# EAGLE schematic Tractive System Board Rev2 (EAGLE 9.6.2)

## Sheet 1 of 4
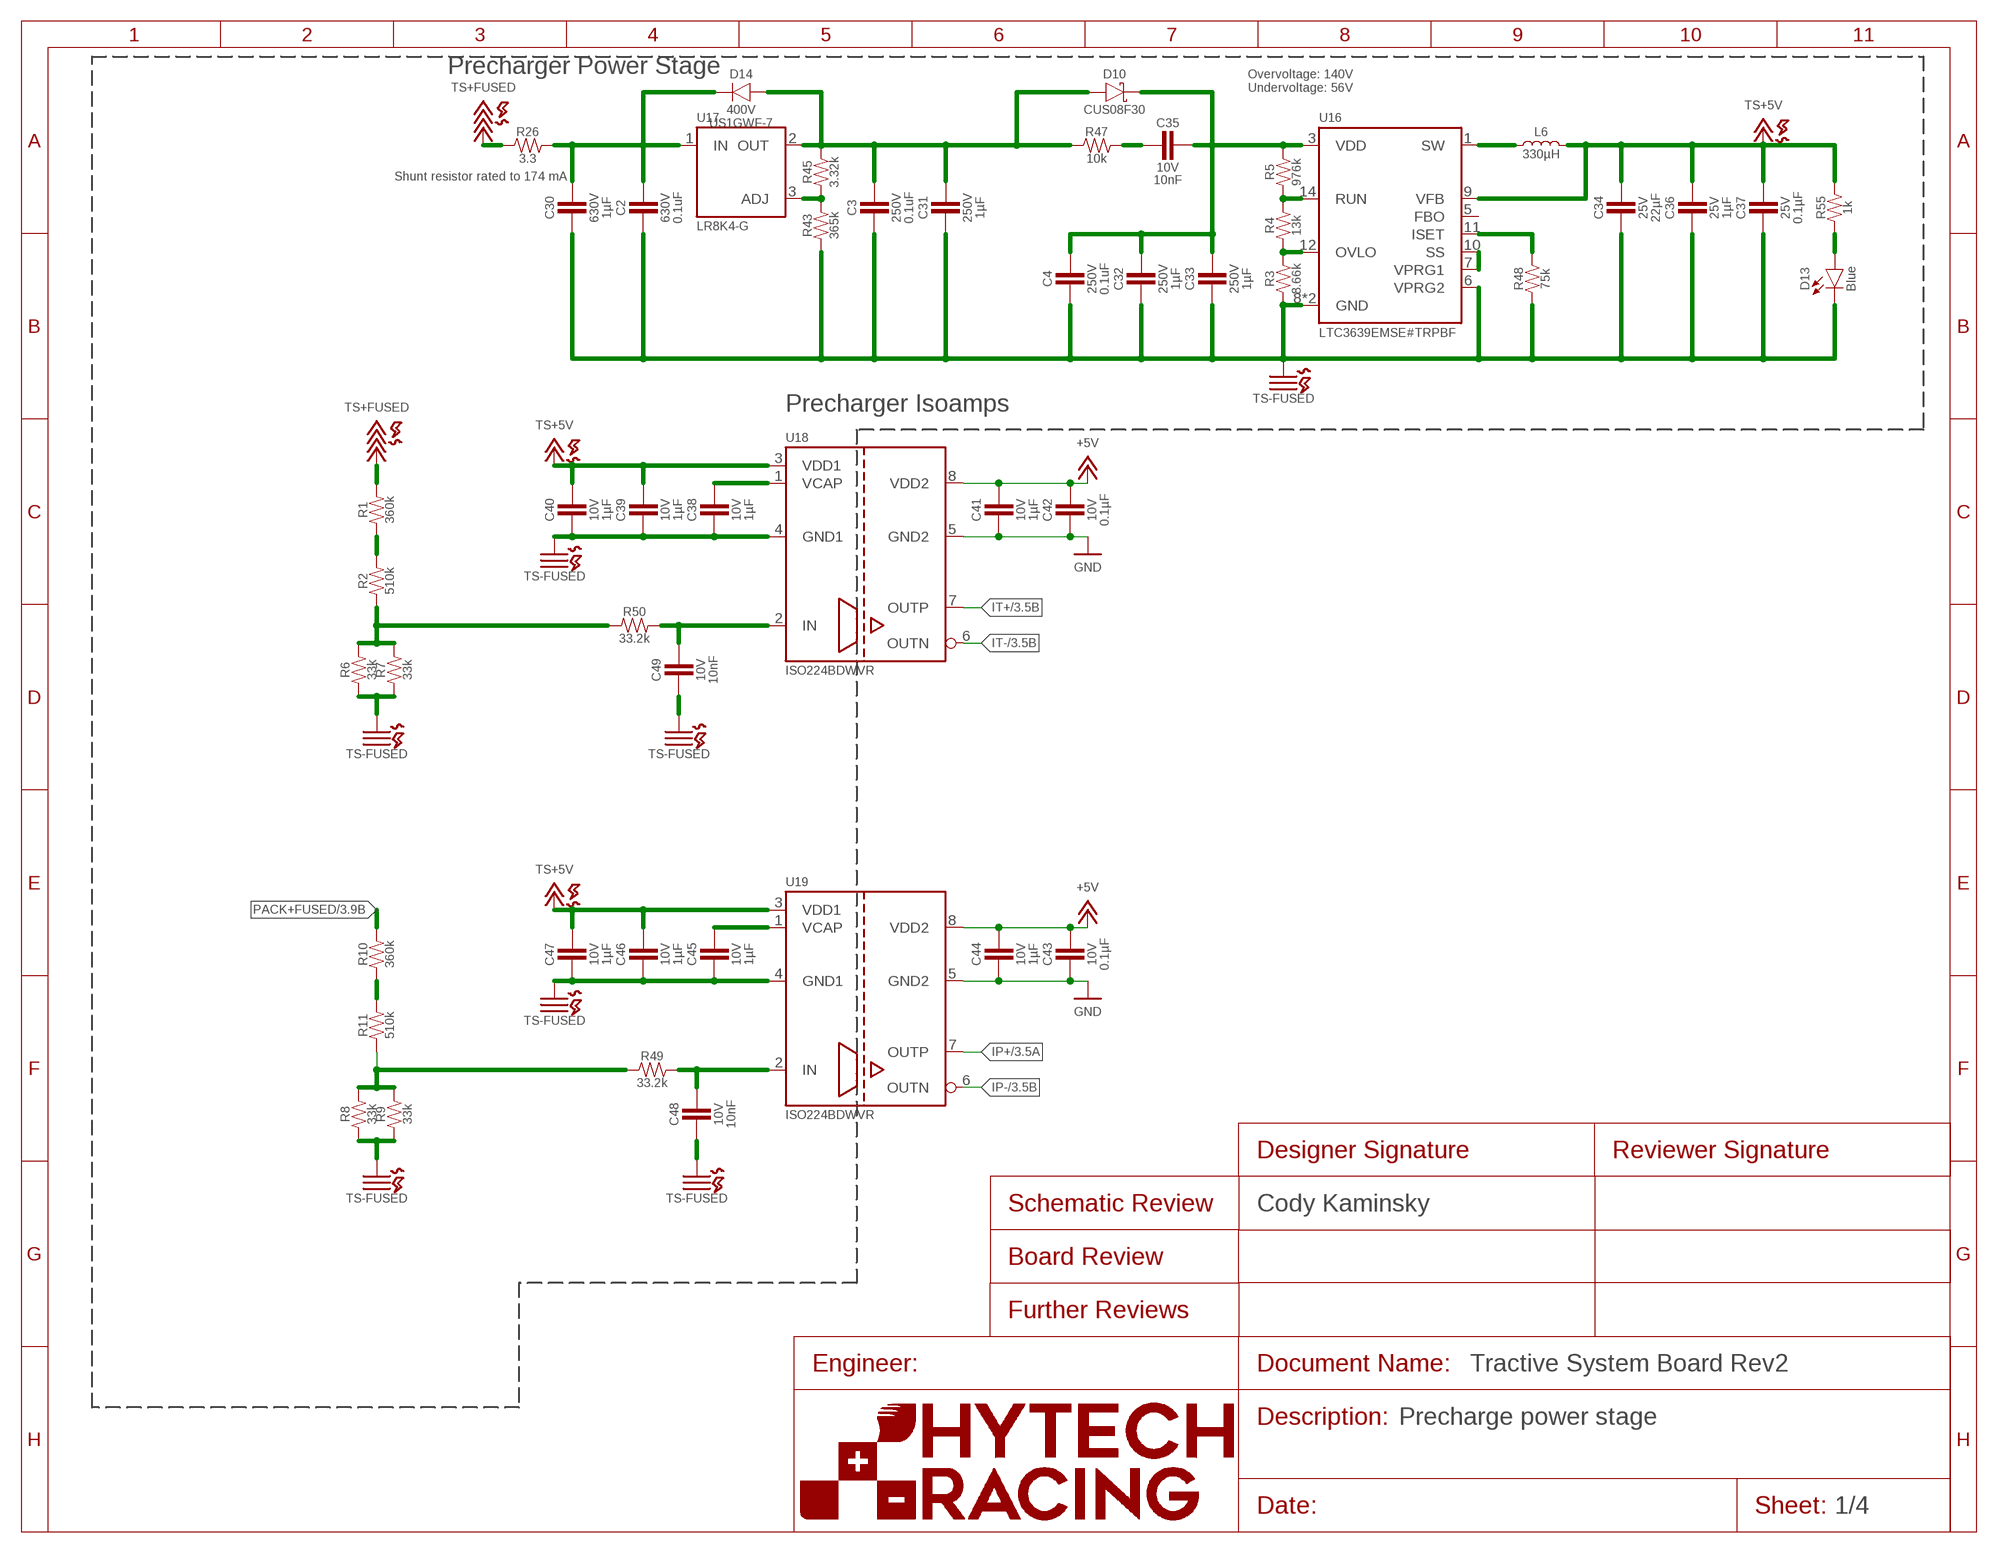
[diagram p0: schematic, sheet 1]
FRAME5 (FRAME): DESCRIPTION_1: Precharge power stage; DESIGNER_SCHEMATIC: Cody Kaminsky

### Parts
C2  CAPACITOR_2220_630V_0.1UF  [2220-CAP]
C3  CAPACITOR_1206_250V_0.1UF  [1206-CAP]
C4  CAPACITOR_1206_250V_0.1UF  [1206-CAP]
C30  CAPACITOR_2220_630V_1UF  [2220-CAP]
C31  CAPACITOR_2220_250V_1UF  [2220-CAP]
C32  CAPACITOR_2220_250V_1UF  [2220-CAP]
C33  CAPACITOR_2220_250V_1UF  [2220-CAP]
C34  CAPACITOR_0805_25V_22UF  [0805-CAP]
C35  CAPACITOR_0603_10V_10NF  [0603-CAP]
C36  CAPACITOR_0603_25V_1UF  [0603-CAP]
C37  CAPACITOR_0603_25V_0.1UF  [0603-CAP]
C38  CAPACITOR_0603_10V_1UF  [0603-CAP]
C39  CAPACITOR_0603_10V_1UF  [0603-CAP]
C40  CAPACITOR_0603_10V_1UF  [0603-CAP]
C41  CAPACITOR_0603_10V_1UF  [0603-CAP]
C42  CAPACITOR_0603_10V_0.1UF  [0603-CAP]
C43  CAPACITOR_0603_10V_0.1UF  [0603-CAP]
C44  CAPACITOR_0603_10V_1UF  [0603-CAP]
C45  CAPACITOR_0603_10V_1UF  [0603-CAP]
C46  CAPACITOR_0603_10V_1UF  [0603-CAP]
C47  CAPACITOR_0603_10V_1UF  [0603-CAP]
C48  CAPACITOR_0603_10V_10NF  [0603-CAP]
C49  CAPACITOR_0603_10V_10NF  [0603-CAP]
D10  SCHOTTKY_SOD323_30V  [SOD-323]
D13  LED_0603_BLUE  [0603-LED]
D14  RECTIFIER_400V_SOD123  [SOD123F]
L6  INDUCTOR_SRU1048_330UH  [SRU1048]
R1  RESISTOR_0603_360K  [0603-RES]
R2  RESISTOR_0603_510K  [0603-RES]
R3  RESISTOR_0603_8.66K  [0603-RES]
R4  RESISTOR_0603_13K  [0603-RES]
R5  RESISTOR_0805_976K  [0805-RES]
R6  RESISTOR_0603_33K  [0603-RES]
R7  RESISTOR_0603_33K  [0603-RES]
R8  RESISTOR_0603_33K  [0603-RES]
R9  RESISTOR_0603_33K  [0603-RES]
R10  RESISTOR_0603_360K  [0603-RES]
R11  RESISTOR_0603_510K  [0603-RES]
R26  RESISTOR_0603_3.3  [0603-RES]
R43  RESISTOR_0805_HV365K  [0805-RES]
R45  RESISTOR_0603_3.32K  [0603-RES]
R47  RESISTOR_0603_10K  [0603-RES]
R48  RESISTOR_0603_75K  [0603-RES]
R49  RESISTOR_0603_33.2K  [0603-RES]
R50  RESISTOR_0603_33.2K  [0603-RES]
R55  RESISTOR_0603_1K  [0603-RES]
U16  LTC3639  [MSE16(12)]
U17  VOLTAGE_REGULATOR_ADJ_LR8_DPAK  [DPAK(2-7K1S)]
U18  ISO224B_AIRGAP  [SOIC-08(WIDE,0.295")-AIRGAP]
U19  ISO224B_AIRGAP  [SOIC-08(WIDE,0.295")-AIRGAP]

### Nets
+5V: C41.1 C42.1 C43.1 C44.1 U18.8(VDD2) U19.8(VDD2) ; also sheet 2,3
GND: C41.2 C42.2 C43.2 C44.2 U18.5(GND2) U19.5(GND2) ; also sheet 2,3
IP+: U19.7(OUTP) ; also sheet 3
IP-: U19.6(OUTN) ; also sheet 3
IT+: U18.7(OUTP) ; also sheet 3
IT-: U18.6(OUTN) ; also sheet 3
N$1: R10.1 R11.2
N$2: R3.2 R4.1 U16.12(OVLO)
N$5: R4.2 R5.1 U16.14(RUN)
N$7: R1.1 R2.2
N$8: R43.2 R45.1 U17.3(ADJ)
N$13: R8.2 R9.2 R11.1 R49.1
N$15: C2.1 C30.1 D14.C R26.2 U17.1(IN)
N$23: R2.1 R6.2 R7.2 R50.1
N$35: D13.2(A) R55.1
N$58: C3.1 C31.1 D10.A D14.A R45.2 R47.1 U17.2(OUT)
N$60: C35.2 R47.2
N$61: C4.1 C32.1 C33.1 C35.1 D10.C R5.2 U16.3(VDD)
N$62: C48.1 R49.2 U19.2(IN)
N$63: C49.1 R50.2 U18.2(IN)
N$64: R48.2 U16.11(ISET)
N$65: L6.1 U16.1(SW)
N$69: C45.1 U19.1(VCAP)
N$73: C38.1 U18.1(VCAP)
N$76: U16.7(VPRG1) U16.10(SS)
PACK+FUSED: R10.2 ; also sheet 3
TS+5V: C34.1 C36.1 C37.1 C39.1 C40.1 C46.1 C47.1 L6.2 R55.2 U16.9(VFB) U18.3(VDD1) U19.3(VDD1) ; also sheet 3
TS+FUSED: R1.2 R26.1 ; also sheet 2,3
TS-FUSED: C2.2 C3.2 C4.2 C30.2 C31.2 C32.2 C33.2 C34.2 C36.2 C37.2 C38.2 C39.2 C40.2 C45.2 C46.2 C47.2 C48.2 C49.2 D13.1(C) R3.1 R6.1 R7.1 R8.1 R9.1 R43.1 R48.1 U16.6(VPRG2) U16.8(GND) U16.16(GND) U18.4(GND1) U19.4(GND1) ; also sheet 2,3
Unconnected: U16.5(FBO)

### Notes on the sheet
- Precharger Power Stage
- Overvoltage: 140V
  Undervoltage: 56V
- Shunt resistor rated to 174 mA
- Precharger Isoamps

## Sheet 2 of 4
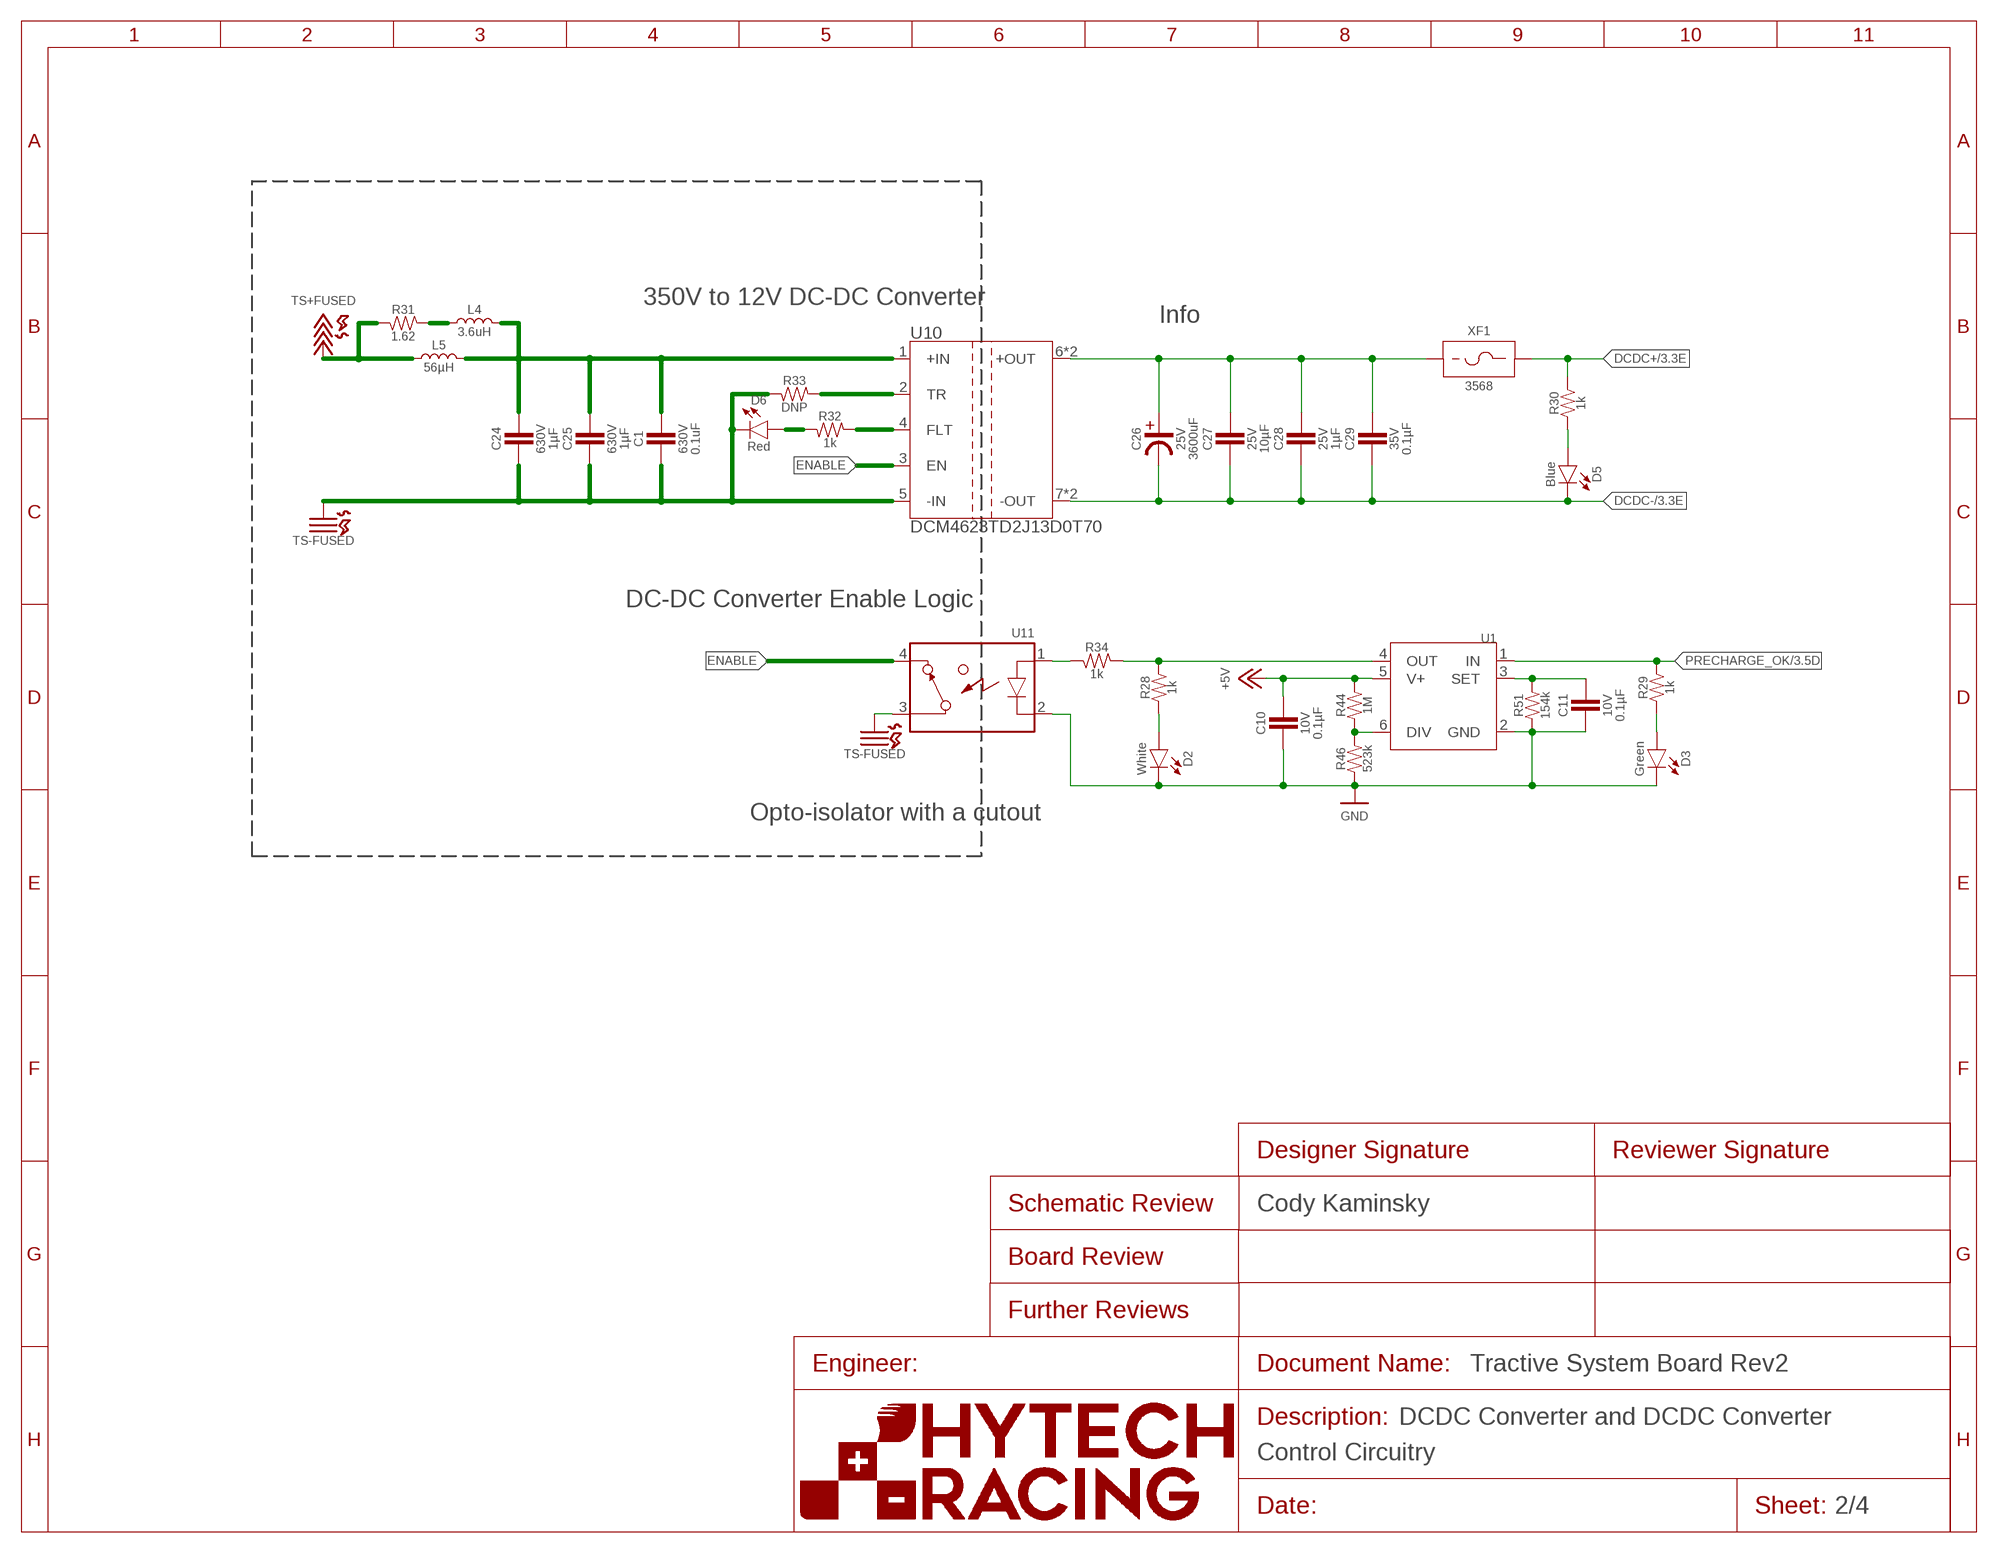
[diagram p1: schematic, sheet 2]
FRAME3 (FRAME): DESCRIPTION_1: DCDC Converter and DCDC Converter; DESCRIPTION_2: Control Circuitry; DESIGNER_SCHEMATIC: Cody Kaminsky

### Parts
C1  CAPACITOR_2220_630V_0.1UF  [2220-CAP]
C10  CAPACITOR_0603_10V_0.1UF  [0603-CAP]
C11  CAPACITOR_0603_10V_0.1UF  [0603-CAP]
C24  CAPACITOR_2220_630V_1UF  [2220-CAP]
C25  CAPACITOR_2220_630V_1UF  [2220-CAP]
C26  CAPACITOR_POLAR__3600UF  [EKYC*MM]
C27  CAPACITOR_0603_25V_10UF  [0603-CAP]
C28  CAPACITOR_0603_25V_1UF  [0603-CAP]
C29  CAPACITOR_0603_35V_0.1UF  [0603-CAP]
D2  LED_0603_WHITE  [0603-LED]
D3  LED_0603_GREEN  [0603-LED]
D5  LED_0603_BLUE  [0603-LED]
D6  LED_0603_RED  [0603-LED]
L4  INDUCTOR_74451133_3.6UH  [74451133]
L5  INDUCTOR_WELMHI_56UH  [WE-LMHI]
R28  RESISTOR_0603_1K  [0603-RES]
R29  RESISTOR_0603_1K  [0603-RES]
R30  RESISTOR_0603_1K  [0603-RES]
R31  RESISTOR_0603_1.62  [0603-RES]
R32  RESISTOR_0603_1K  [0603-RES]
R33  RESISTOR_0603_DNP  [0603-RES]
R34  RESISTOR_0603_1K  [0603-RES]
R44  RESISTOR_0805_1M  [0805-RES]
R46  RESISTOR_0805_523K  [0805-RES]
R51  RESISTOR_0603_154K  [0603-RES]
U1  LTC6994_1  [SOT-23-6]
U10  DCM4623TD2J13D0T70  [DCM4623]
U11  RELAY_SOLIDSTATE_NC_AG  [DIP-4_AIRGAP]
XF1  FUSE_HOLDER_MINIBLADEPTH  [3568]

### Nets
+5V: C10.1 R44.2 U1.5(V+) ; also sheet 1,3
DCDC+: R30.2 XF1.3 XF1.4 ; also sheet 3
DCDC-: C26.-(MINUS) C27.1 C28.1 C29.1 D5.1(C) U10.7(-OUT) U10.9(-OUT) ; also sheet 3
ENABLE: U10.3(EN) U11.4(CONTACT2)
GND: C10.2 C11.2 D2.1(C) D3.1(C) R46.1 R51.1 U1.2(GND) U11.2(CONTROL-) ; also sheet 1,3
N$4: R44.1 R46.2 U1.6(DIV)
N$6: R34.2 U11.1(CONTROL+)
N$14: C11.1 R51.2 U1.3(SET)
N$16: R28.2 R34.1 U1.4(OUT)
N$17: D2.2(A) R28.1
N$18: D5.2(A) R30.1
N$22: D3.2(A) R29.1
N$29: L4.2 R31.1
N$39: C1.1 C24.1 C25.1 L4.1 L5.1 U10.1(+IN)
N$43: D6.2(A) R32.2
N$44: R32.1 U10.4(FLT)
N$45: R33.1 U10.2(TR)
N$46: C26.+(PLUS) C27.2 C28.2 C29.2 U10.6(+OUT) U10.8(+OUT) XF1.1 XF1.2
PRECHARGE_OK: R29.2 U1.1(IN) ; also sheet 3
TS+FUSED: L5.2 R31.2 ; also sheet 1,3
TS-FUSED: C1.2 C24.2 C25.2 D6.1(C) R33.2 U10.5(-IN) U11.3(CONTACT1) ; also sheet 1,3

### Notes on the sheet
- 350V to 12V DC-DC Converter
- Info
- DC-DC Converter Enable Logic
- Opto-isolator with a cutout

## Sheet 3 of 4
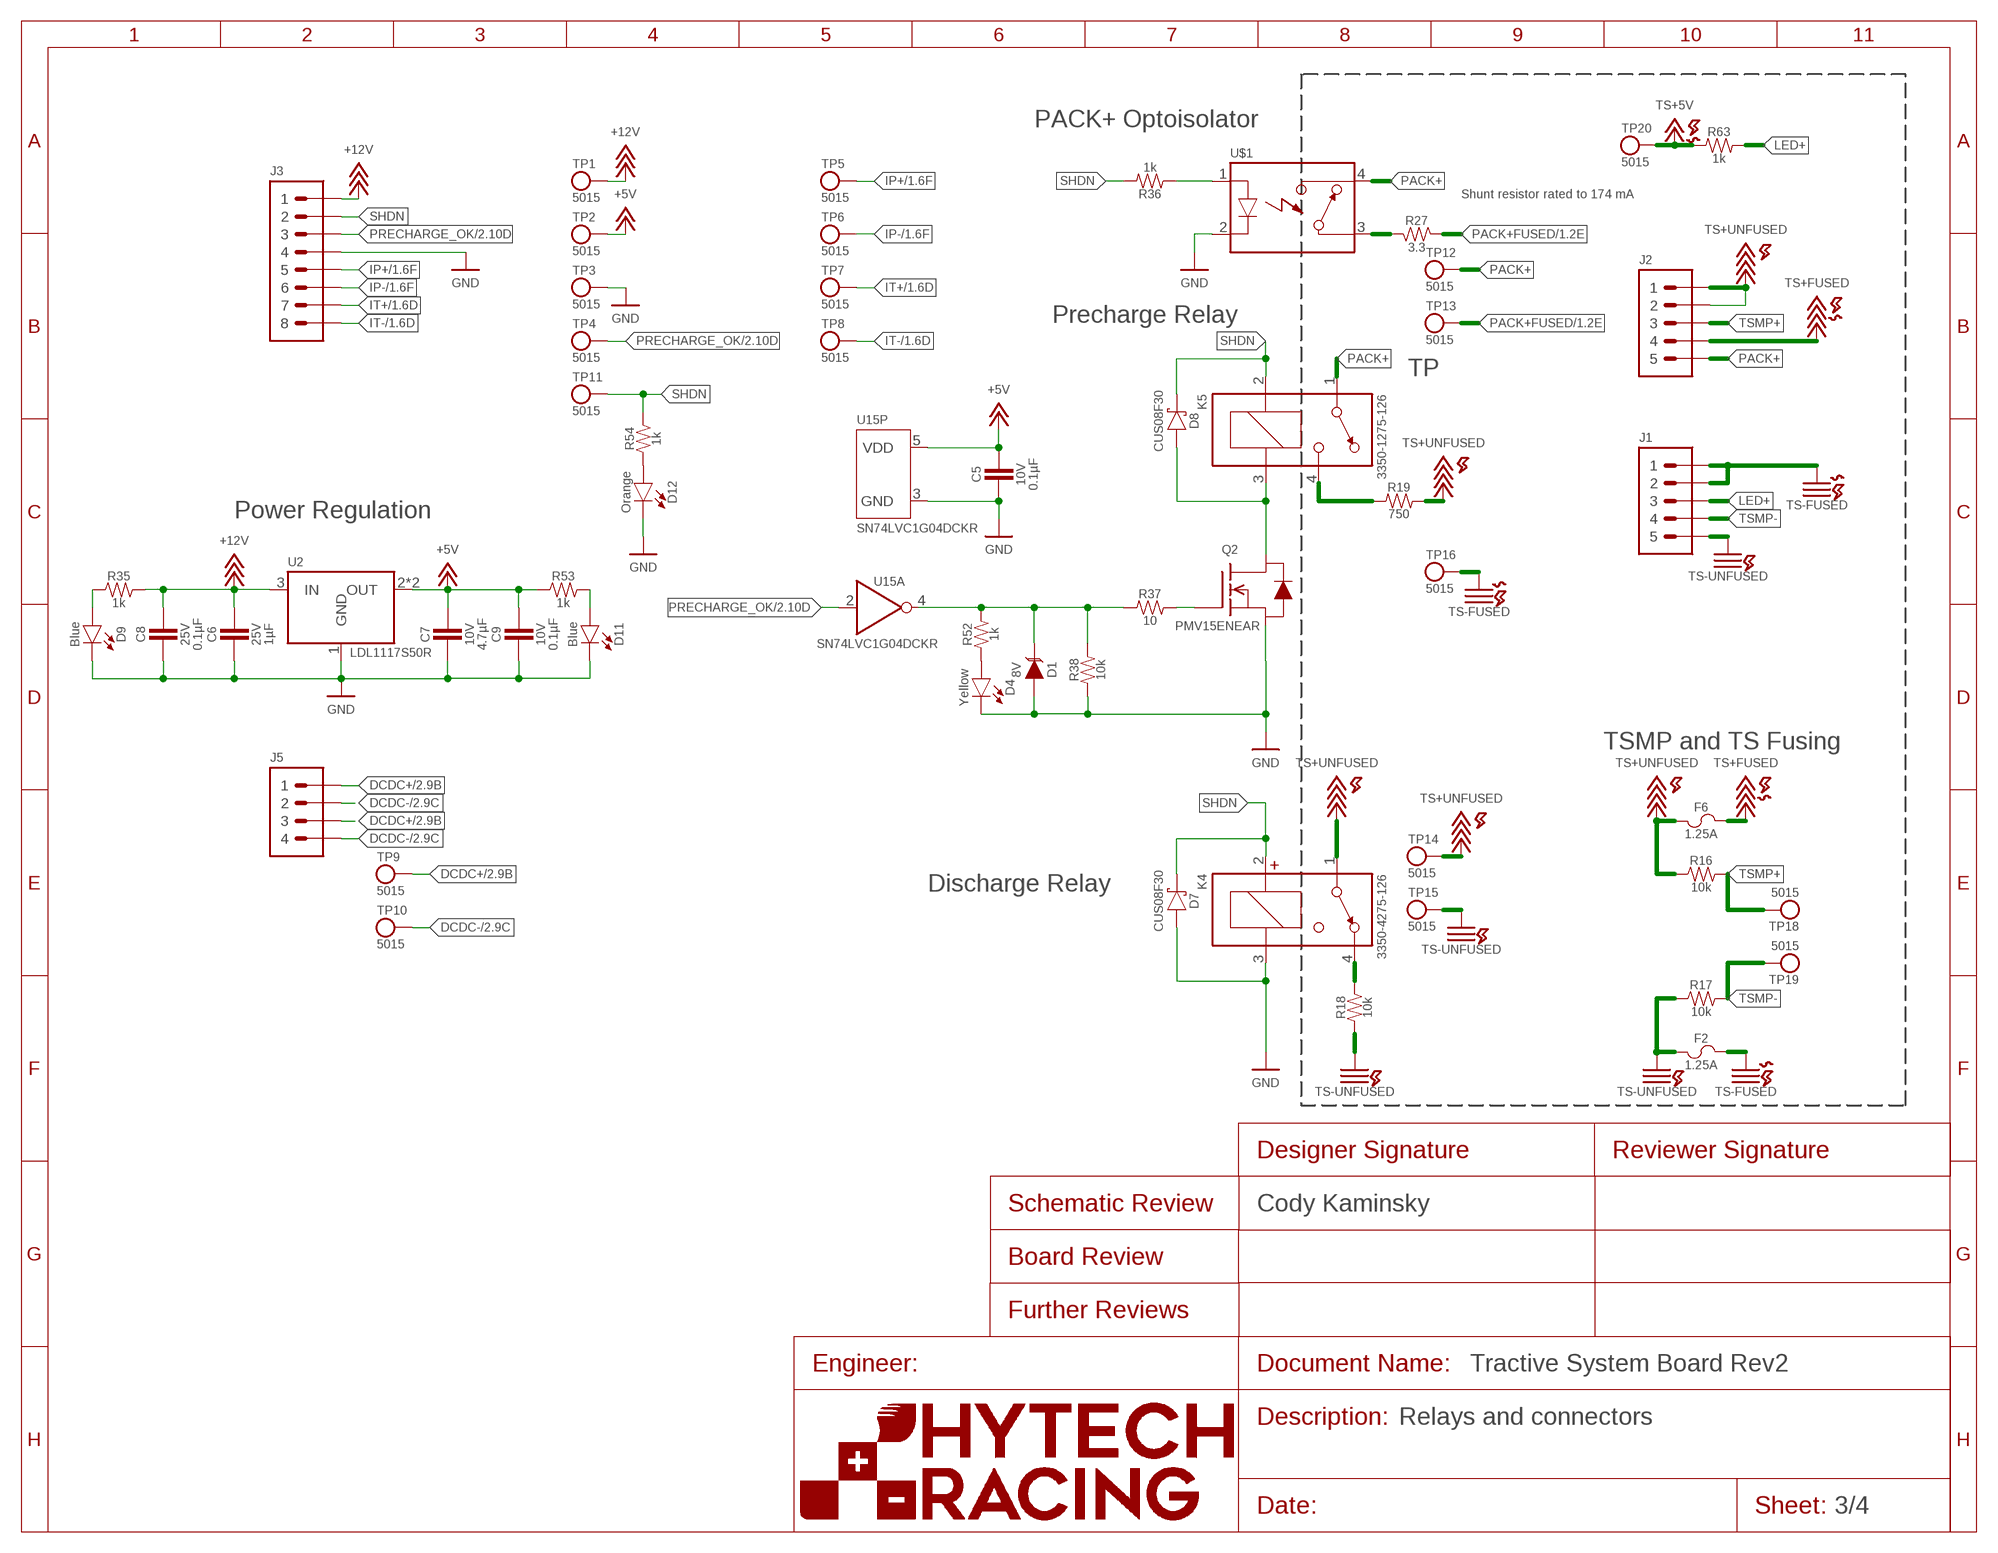
[diagram p2: schematic, sheet 3]
FRAME4 (FRAME): DESCRIPTION_1: Relays and connectors; DESIGNER_SCHEMATIC: Cody Kaminsky

### Parts
C5  CAPACITOR_0603_10V_0.1UF  [0603-CAP]
C6  CAPACITOR_0603_25V_1UF  [0603-CAP]
C7  CAPACITOR_0603_10V_4.7UF  [0603-CAP]
C8  CAPACITOR_0603_25V_0.1UF  [0603-CAP]
C9  CAPACITOR_0603_10V_0.1UF  [0603-CAP]
D1  TVS_8V  [SOT-23]
D4  LED_0603_YELLOW  [0603-LED]
D7  SCHOTTKY_SOD323_30V  [SOD-323]
D8  SCHOTTKY_SOD323_30V  [SOD-323]
D9  LED_0603_BLUE  [0603-LED]
D11  LED_0603_BLUE  [0603-LED]
D12  LED_0603_ORANGE  [0603-LED]
F2  FUSE_0885_1.25  [0885]
F6  FUSE_0885_1.25  [0885]
J1  CONNECTOR-5_MICRO_V6S_  [MOLEX_MICROFIT_PTH_VERTICAL_06_SINGLE_SPACED]
J2  CONNECTOR-5_MICRO_V7S_  [MOLEX_MICROFIT_PTH_VERTICAL_07_SINGLE_SPACED]
J3  CONNECTOR-8_S_S  [FLEX_STACK_PTH_08_DUAL]
J5  CONNECTOR-4__  [MOLEX_MICROFIT_PTH_VERTICAL_04_DUAL]
K4  RELAY_SPST_NC_POLARIZED_3550_12  [335X]
K5  RELAY_SPST_NO_3550_12  [335X]
Q2  TRANSISTOR_N_MOS__PMV15ENEA  [SOT-23]
R16  RESISTOR_B20_10K  [B20]
R17  RESISTOR_B20_10K  [B20]
R18  RESISTOR_B20_10K  [B20]
R19  RESISTOR_B20_750  [B20]
R27  RESISTOR_0603_3.3  [0603-RES]
R35  RESISTOR_0603_1K  [0603-RES]
R36  RESISTOR_0603_1K  [0603-RES]
R37  RESISTOR_0603_10  [0603-RES]
R38  RESISTOR_0603_10K  [0603-RES]
R52  RESISTOR_0603_1K  [0603-RES]
R53  RESISTOR_0603_1K  [0603-RES]
R54  RESISTOR_0603_1K  [0603-RES]
R63  RESISTOR_0603_1K  [0603-RES]
TP1  TEST_POINT  [MICRO_MINIATURE]
TP2  TEST_POINT  [MICRO_MINIATURE]
TP3  TEST_POINT  [MICRO_MINIATURE]
TP4  TEST_POINT  [MICRO_MINIATURE]
TP5  TEST_POINT  [MICRO_MINIATURE]
TP6  TEST_POINT  [MICRO_MINIATURE]
TP7  TEST_POINT  [MICRO_MINIATURE]
TP8  TEST_POINT  [MICRO_MINIATURE]
TP9  TEST_POINT  [MICRO_MINIATURE]
TP10  TEST_POINT  [MICRO_MINIATURE]
TP11  TEST_POINT  [MICRO_MINIATURE]
TP12  TEST_POINT  [MICRO_MINIATURE]
TP13  TEST_POINT  [MICRO_MINIATURE]
TP14  TEST_POINT  [MICRO_MINIATURE]
TP15  TEST_POINT  [MICRO_MINIATURE]
TP16  TEST_POINT  [MICRO_MINIATURE]
TP18  TEST_POINT  [MICRO_MINIATURE]
TP19  TEST_POINT  [MICRO_MINIATURE]
TP20  TEST_POINT  [MICRO_MINIATURE]
U2  VOLTAGE_REGULATOR_SOT223_5V  [SOT223]
U15  LOGICGATE_INVERTER_DCKR  [SC-70-5]
U$1  RELAY_SOLIDSTATE_NO  [DIP-4]

### Nets
+5V: C5.1 C7.1 C9.1 R53.1 TP2.1 U2.2(OUT) U2.4(OUT) U15.5(P:VDD) ; also sheet 1,2
+12V: C6.1 C8.1 J3.1 R35.2 TP1.1 U2.3(IN)
DCDC+: J5.1 J5.3 TP9.1 ; also sheet 2
DCDC-: J5.2 J5.4 TP10.1 ; also sheet 2
GND: C5.2 C6.2 C7.2 C8.2 C9.2 D1.1(A) D4.1(C) D7.A D9.1(C) D11.1(C) D12.1(C) J3.4 K4.3(COIL-) Q2.2(S) R38.1 TP3.1 U2.1(GND) U15.3(P:GND) U$1.2(CONTROL-) ; also sheet 1,2
IP+: J3.5 TP5.1 ; also sheet 1
IP-: J3.6 TP6.1 ; also sheet 1
IT+: J3.7 TP7.1 ; also sheet 1
IT-: J3.8 TP8.1 ; also sheet 1
LED+: J1.3 R63.2
N$3: Q2.1(G) R37.2
N$24: D4.2(A) R52.1
N$25: D9.2(A) R35.1
N$30: D11.2(A) R53.2
N$31: D12.2(A) R54.1
N$40: D8.A K5.3(COIL-) Q2.3(D)
N$50: K5.4(CONTACT2) R19.1
N$51: K4.4(CONTACT2) R18.2
N$52: D1.3(C) R37.1 R38.2 R52.2 U15.4(A:!IN)
N$53: R36.1 U$1.1(CONTROL+)
N$57: R27.2 U$1.3(CONTACT1)
PACK+: J2.5 K5.1(CONTACT1) TP12.1 U$1.4(CONTACT2)
PACK+FUSED: R27.1 TP13.1 ; also sheet 1
PRECHARGE_OK: J3.3 TP4.1 U15.2(A:IN) ; also sheet 2
SHDN: D7.C D8.C J3.2 K4.2(COIL+) K5.2(COIL+) R36.2 R54.2 TP11.1
TS+5V: R63.1 TP20.1 ; also sheet 1
TS+FUSED: F6.2 J2.4 ; also sheet 1,2
TS+UNFUSED: F6.1 J2.1 J2.2 K4.1(CONTACT1) R16.1 R19.2 TP14.1
TS-FUSED: F2.2 J1.1 J1.2 TP16.1 ; also sheet 1,2
TS-UNFUSED: F2.1 J1.5 R17.1 R18.1 TP15.1
TSMP+: J2.3 R16.2 TP18.1
TSMP-: J1.4 R17.2 TP19.1

### Notes on the sheet
- PACK+ Optoisolator
- Shunt resistor rated to 174 mA
- Precharge Relay
- TP
- Power Regulation
- TSMP and TS Fusing
- Discharge Relay

## Sheet 4 of 4
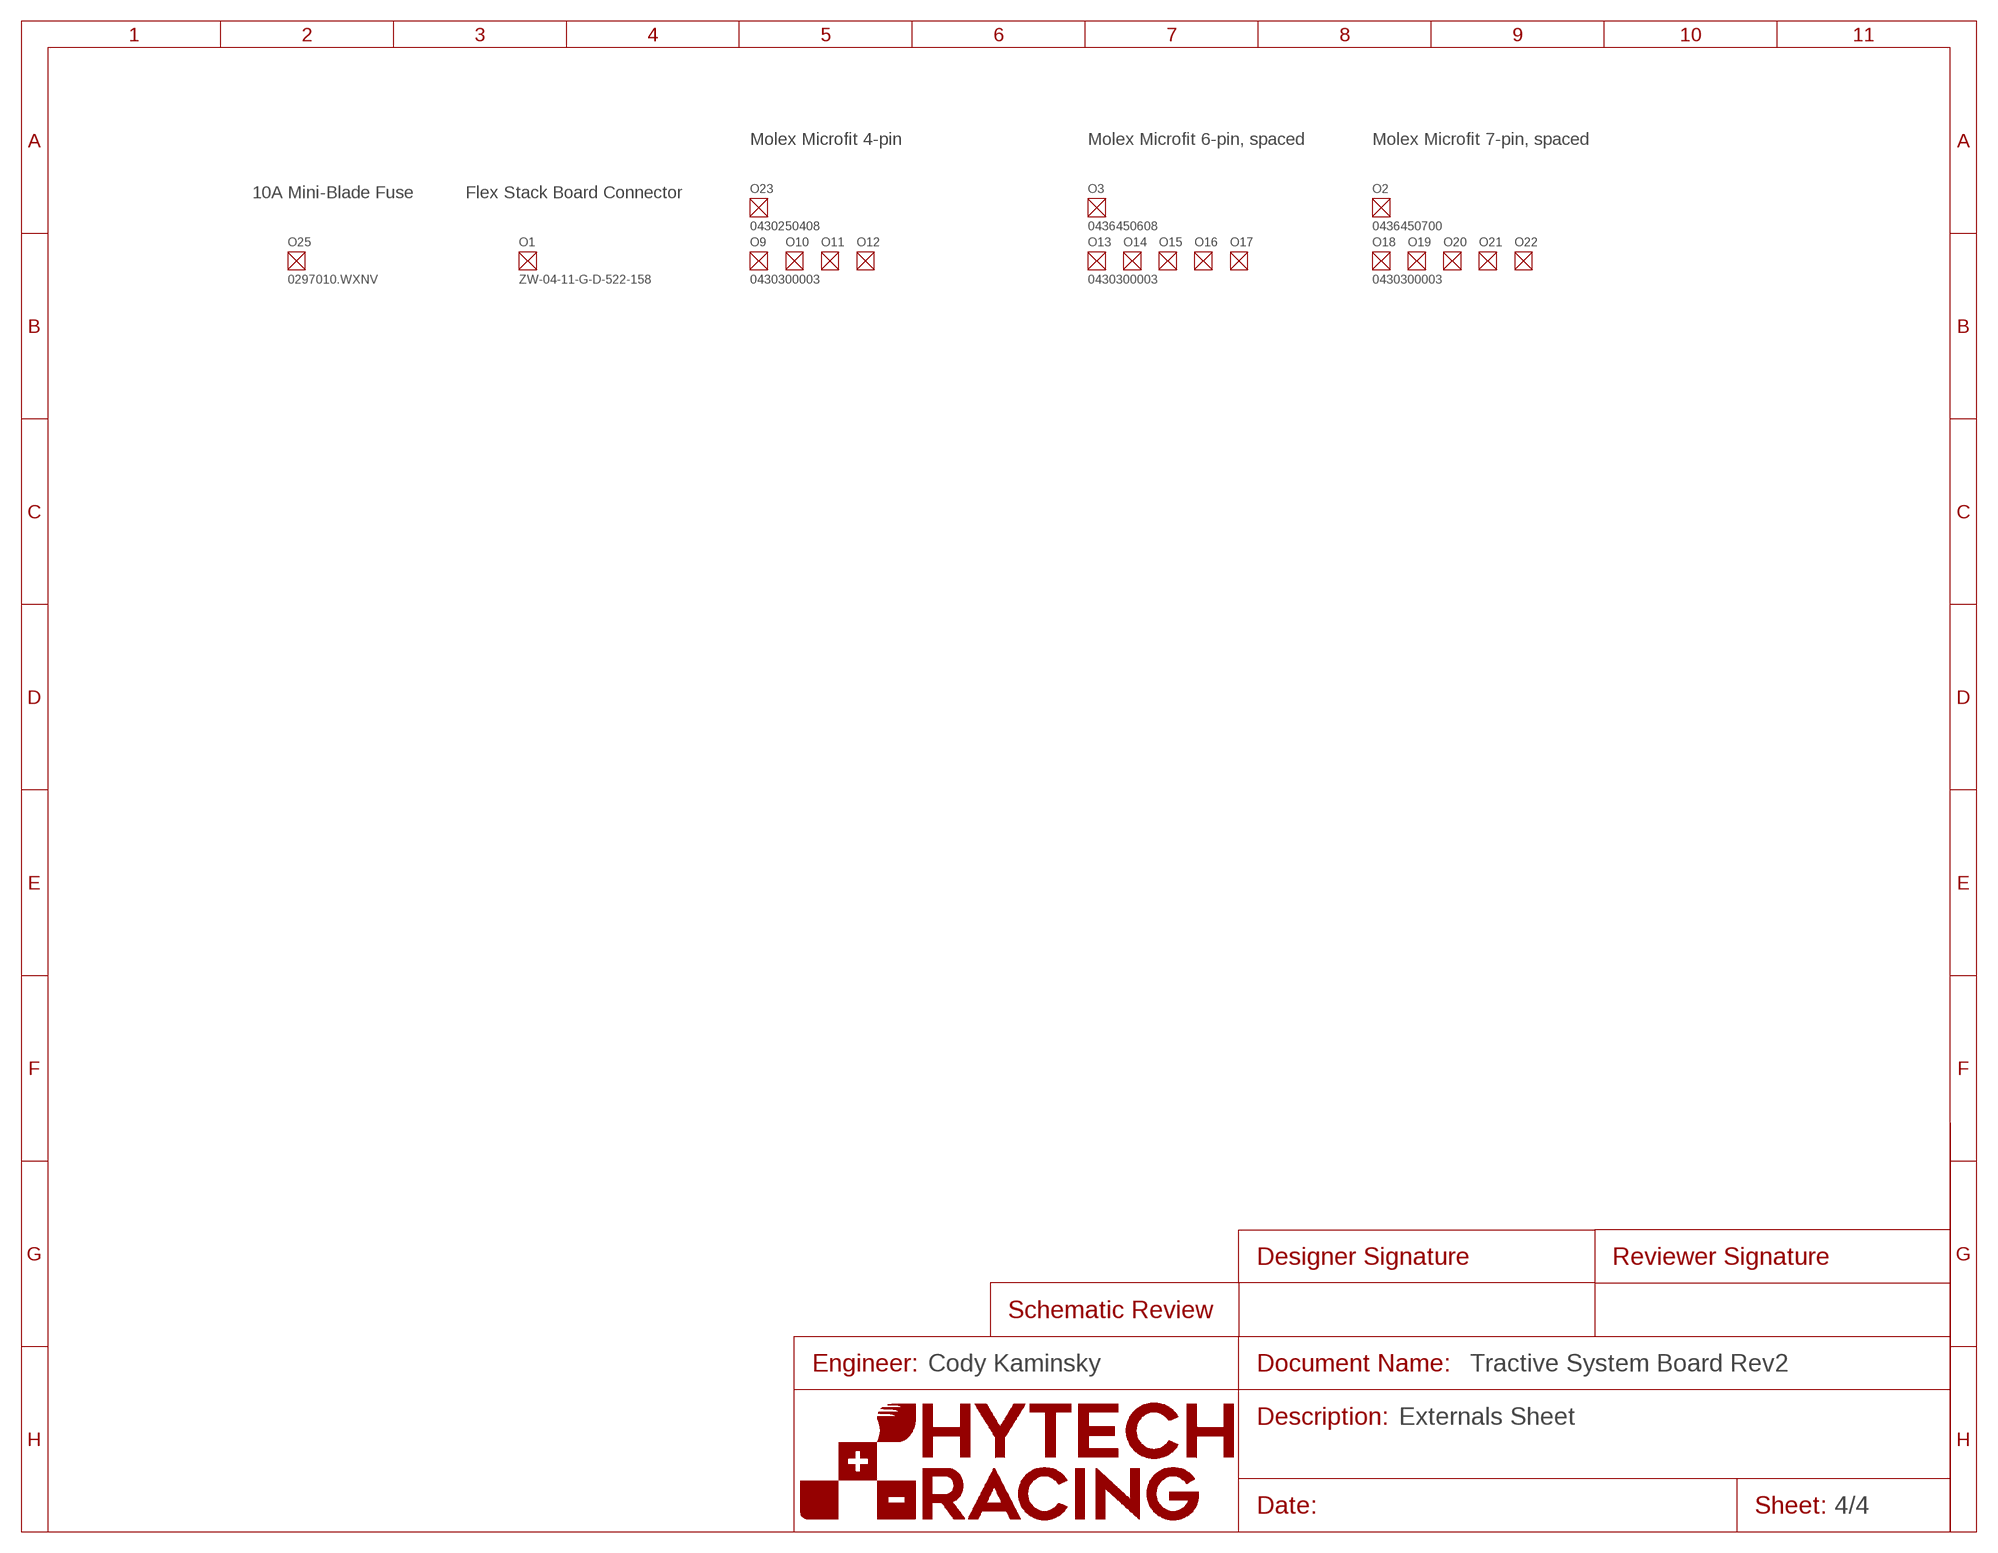
[diagram p3: schematic, sheet 4]
O1 (RECEPTACLE-8_FLEXSTACK): DKPN: ZW-04-11-G-D-522-158-ND; MANUFACTURER: Samtec Inc; MOPN: 200-ZW0411GD522158; MPN: ZW-04-11-G-D-522-158
O2 (RECEPTACLE-7_MICROFIT): DKPN: WM2405-ND; MANUFACTURER: Molex; MOPN: 538-43645-0700; MPN: 0436450700
O3 (RECEPTACLE-6_SINGLE_MICROFIT): DKPN: WM13217-ND; MANUFACTURER: Molex; MOPN: 538-43645-0608; MPN: 0436450608
O9 (CRIMP_MICROFIT_20-24): DKPN: WM2776CT-ND; GAUGE: 20-24; MANUFACTURER: Molex; MOPN: 538-43030-0003; MPN: 0430300003
O10 (CRIMP_MICROFIT_20-24): DKPN: WM2776CT-ND; GAUGE: 20-24; MANUFACTURER: Molex; MOPN: 538-43030-0003; MPN: 0430300003
O11 (CRIMP_MICROFIT_20-24): DKPN: WM2776CT-ND; GAUGE: 20-24; MANUFACTURER: Molex; MOPN: 538-43030-0003; MPN: 0430300003
O12 (CRIMP_MICROFIT_20-24): DKPN: WM2776CT-ND; GAUGE: 20-24; MANUFACTURER: Molex; MOPN: 538-43030-0003; MPN: 0430300003
O13 (CRIMP_MICROFIT_20-24): DKPN: WM2776CT-ND; GAUGE: 20-24; MANUFACTURER: Molex; MOPN: 538-43030-0003; MPN: 0430300003
O14 (CRIMP_MICROFIT_20-24): DKPN: WM2776CT-ND; GAUGE: 20-24; MANUFACTURER: Molex; MOPN: 538-43030-0003; MPN: 0430300003
O15 (CRIMP_MICROFIT_20-24): DKPN: WM2776CT-ND; GAUGE: 20-24; MANUFACTURER: Molex; MOPN: 538-43030-0003; MPN: 0430300003
O16 (CRIMP_MICROFIT_20-24): DKPN: WM2776CT-ND; GAUGE: 20-24; MANUFACTURER: Molex; MOPN: 538-43030-0003; MPN: 0430300003
O17 (CRIMP_MICROFIT_20-24): DKPN: WM2776CT-ND; GAUGE: 20-24; MANUFACTURER: Molex; MOPN: 538-43030-0003; MPN: 0430300003
O18 (CRIMP_MICROFIT_20-24): DKPN: WM2776CT-ND; GAUGE: 20-24; MANUFACTURER: Molex; MOPN: 538-43030-0003; MPN: 0430300003
O19 (CRIMP_MICROFIT_20-24): DKPN: WM2776CT-ND; GAUGE: 20-24; MANUFACTURER: Molex; MOPN: 538-43030-0003; MPN: 0430300003
O20 (CRIMP_MICROFIT_20-24): DKPN: WM2776CT-ND; GAUGE: 20-24; MANUFACTURER: Molex; MOPN: 538-43030-0003; MPN: 0430300003
O21 (CRIMP_MICROFIT_20-24): DKPN: WM2776CT-ND; GAUGE: 20-24; MANUFACTURER: Molex; MOPN: 538-43030-0003; MPN: 0430300003
O22 (CRIMP_MICROFIT_20-24): DKPN: WM2776CT-ND; GAUGE: 20-24; MANUFACTURER: Molex; MOPN: 538-43030-0003; MPN: 0430300003
O23 (RECEPTACLE-4_MICROFIT): DKPN: WM11225-ND; MANUFACTURER: Molex; MOPN: 538-43025-0408; MPN: 0430250408
O25 (FUSE_MINI_BLADE_10): DKPN: F991-ND; MANUFACTURER: Littelfuse; MOPN: 576-0297010.WXNV; MPN: 0297010.WXNV
U$49 (FRAME_SCHEMATIC_ONLY): DESCRIPTION_1: Externals Sheet; ENGINEER: Cody Kaminsky

### Notes on the sheet
- Molex Microfit 4-pin | Molex Microfit 6-pin, spaced | Molex Microfit 7-pin, spaced
- 10A Mini-Blade Fuse | Flex Stack Board Connector

## Library data of the parts
C1 C2 = HyTechDevices:CAPACITOR_?_*: Capacitor, Non-Polarized VJ...1BC Series Datasheet <https://www.mouser.com/datasheet/2/427/vjw1bcbascomseries-1762447.pdf> Samsung Datasheet <https://www.mouser.com/datasheet/2/585/MLCC-1837944.pdf> Walsin Datasheet <https://www.mouser.com/datasheet/2/210/WTC_MLCC_General_Purpose-1534899.pdf> GRM188R61A226ME15D <https://www.mouser.com/datasheet/2/281/1/GRM188R61A226ME15_02A-1985787.pdf> GRM188R61E106MA73D <https://www.mouser.com/datasheet/2/281/1/GRM188R61E106MA73_01A-1985806.pdf> 885012006013 <https://www.mouser.com/datasheet/2/445/885012006013-1726946.pdf> 2220Y6300105KXTWS2 <https://www.mouser.com/datasheet/2/218/SMD_High_and_Std_StackiCap_P62-1825512.pdf> Yageo Class 2, X5R <https://www.mouser.com/datasheet/2/447/UPY_GPHC_X5R_4V_to_50V_26-1827097.pdf> TDK C Series <https://www.mouser.com/ProductDetail/TDK/C3216X5R1V226M160AC?qs=%2Fha2pyFadujbcx9jh7lYl%2F4NeMoXFhdc8AqVWNq4wW6M2y7zl6GzBuhgtI0ngznN> AVX Automotive MLCC <https://www.mouser.com/datasheet/2/40/AutoMLCC-777028.pdf> KEMET X7R Series <https://www.mouser.com/datasheet/2/212/KEM_C1002_X7R_SMD-1102033.pdf>; CAPACITANCE: 0.1uF; DKPN: 445-11980-2-ND; MANUFACTURER: TDK Coporation; MOPN: 810-C5750CH2J104K2KC; MPN: C5750CH2J104K280KC; TOLERANCE: 10%; VOLTAGE: 630V
C3 C4 = HyTechDevices:CAPACITOR_?_*: Capacitor, Non-Polarized VJ...1BC Series Datasheet <https://www.mouser.com/datasheet/2/427/vjw1bcbascomseries-1762447.pdf> Samsung Datasheet <https://www.mouser.com/datasheet/2/585/MLCC-1837944.pdf> Walsin Datasheet <https://www.mouser.com/datasheet/2/210/WTC_MLCC_General_Purpose-1534899.pdf> GRM188R61A226ME15D <https://www.mouser.com/datasheet/2/281/1/GRM188R61A226ME15_02A-1985787.pdf> GRM188R61E106MA73D <https://www.mouser.com/datasheet/2/281/1/GRM188R61E106MA73_01A-1985806.pdf> 885012006013 <https://www.mouser.com/datasheet/2/445/885012006013-1726946.pdf> 2220Y6300105KXTWS2 <https://www.mouser.com/datasheet/2/218/SMD_High_and_Std_StackiCap_P62-1825512.pdf> Yageo Class 2, X5R <https://www.mouser.com/datasheet/2/447/UPY_GPHC_X5R_4V_to_50V_26-1827097.pdf> TDK C Series <https://www.mouser.com/ProductDetail/TDK/C3216X5R1V226M160AC?qs=%2Fha2pyFadujbcx9jh7lYl%2F4NeMoXFhdc8AqVWNq4wW6M2y7zl6GzBuhgtI0ngznN> AVX Automotive MLCC <https://www.mouser.com/datasheet/2/40/AutoMLCC-777028.pdf> KEMET X7R Series <https://www.mouser.com/datasheet/2/212/KEM_C1002_X7R_SMD-1102033.pdf>; CAPACITANCE: 0.1uF; DKPN: 445-6079-2-ND; MANUFACTURER: TDK Corporation; MOPN: 810-C3216X7R2E104KT5; MPN: C3216X7R2E104K160AM; TOLERANCE: 10%; VOLTAGE: 250V
C5 C9-C11 C42 C43 = HyTechDevices:CAPACITOR_?_*: Capacitor, Non-Polarized VJ...1BC Series Datasheet <https://www.mouser.com/datasheet/2/427/vjw1bcbascomseries-1762447.pdf> Samsung Datasheet <https://www.mouser.com/datasheet/2/585/MLCC-1837944.pdf> Walsin Datasheet <https://www.mouser.com/datasheet/2/210/WTC_MLCC_General_Purpose-1534899.pdf> GRM188R61A226ME15D <https://www.mouser.com/datasheet/2/281/1/GRM188R61A226ME15_02A-1985787.pdf> GRM188R61E106MA73D <https://www.mouser.com/datasheet/2/281/1/GRM188R61E106MA73_01A-1985806.pdf> 885012006013 <https://www.mouser.com/datasheet/2/445/885012006013-1726946.pdf> 2220Y6300105KXTWS2 <https://www.mouser.com/datasheet/2/218/SMD_High_and_Std_StackiCap_P62-1825512.pdf> Yageo Class 2, X5R <https://www.mouser.com/datasheet/2/447/UPY_GPHC_X5R_4V_to_50V_26-1827097.pdf> TDK C Series <https://www.mouser.com/ProductDetail/TDK/C3216X5R1V226M160AC?qs=%2Fha2pyFadujbcx9jh7lYl%2F4NeMoXFhdc8AqVWNq4wW6M2y7zl6GzBuhgtI0ngznN> AVX Automotive MLCC <https://www.mouser.com/datasheet/2/40/AutoMLCC-777028.pdf> KEMET X7R Series <https://www.mouser.com/datasheet/2/212/KEM_C1002_X7R_SMD-1102033.pdf>; CAPACITANCE: 0.1µF; DKPN: 720-1688-1-ND; MANUFACTURER: Vishay Vitramon; MOPN: 77-VJ0603Y104JXQPBC; MPN: VJ0603Y104JXQPW1BC; TOLERANCE: 5%; VOLTAGE: 10V
C6 C28 C36 = HyTechDevices:CAPACITOR_?_*: Capacitor, Non-Polarized VJ...1BC Series Datasheet <https://www.mouser.com/datasheet/2/427/vjw1bcbascomseries-1762447.pdf> Samsung Datasheet <https://www.mouser.com/datasheet/2/585/MLCC-1837944.pdf> Walsin Datasheet <https://www.mouser.com/datasheet/2/210/WTC_MLCC_General_Purpose-1534899.pdf> GRM188R61A226ME15D <https://www.mouser.com/datasheet/2/281/1/GRM188R61A226ME15_02A-1985787.pdf> GRM188R61E106MA73D <https://www.mouser.com/datasheet/2/281/1/GRM188R61E106MA73_01A-1985806.pdf> 885012006013 <https://www.mouser.com/datasheet/2/445/885012006013-1726946.pdf> 2220Y6300105KXTWS2 <https://www.mouser.com/datasheet/2/218/SMD_High_and_Std_StackiCap_P62-1825512.pdf> Yageo Class 2, X5R <https://www.mouser.com/datasheet/2/447/UPY_GPHC_X5R_4V_to_50V_26-1827097.pdf> TDK C Series <https://www.mouser.com/ProductDetail/TDK/C3216X5R1V226M160AC?qs=%2Fha2pyFadujbcx9jh7lYl%2F4NeMoXFhdc8AqVWNq4wW6M2y7zl6GzBuhgtI0ngznN> AVX Automotive MLCC <https://www.mouser.com/datasheet/2/40/AutoMLCC-777028.pdf> KEMET X7R Series <https://www.mouser.com/datasheet/2/212/KEM_C1002_X7R_SMD-1102033.pdf>; CAPACITANCE: 1µF; DKPN: 1276-1184-1-ND; MANUFACTURER: Samsung Electro-Mechanics; MOPN: 187-CL10B105KA8NNNC; MPN: CL10B105KA8NNNC; TOLERANCE: 10%; VOLTAGE: 25V
C7 = HyTechDevices:CAPACITOR_?_*: Capacitor, Non-Polarized VJ...1BC Series Datasheet <https://www.mouser.com/datasheet/2/427/vjw1bcbascomseries-1762447.pdf> Samsung Datasheet <https://www.mouser.com/datasheet/2/585/MLCC-1837944.pdf> Walsin Datasheet <https://www.mouser.com/datasheet/2/210/WTC_MLCC_General_Purpose-1534899.pdf> GRM188R61A226ME15D <https://www.mouser.com/datasheet/2/281/1/GRM188R61A226ME15_02A-1985787.pdf> GRM188R61E106MA73D <https://www.mouser.com/datasheet/2/281/1/GRM188R61E106MA73_01A-1985806.pdf> 885012006013 <https://www.mouser.com/datasheet/2/445/885012006013-1726946.pdf> 2220Y6300105KXTWS2 <https://www.mouser.com/datasheet/2/218/SMD_High_and_Std_StackiCap_P62-1825512.pdf> Yageo Class 2, X5R <https://www.mouser.com/datasheet/2/447/UPY_GPHC_X5R_4V_to_50V_26-1827097.pdf> TDK C Series <https://www.mouser.com/ProductDetail/TDK/C3216X5R1V226M160AC?qs=%2Fha2pyFadujbcx9jh7lYl%2F4NeMoXFhdc8AqVWNq4wW6M2y7zl6GzBuhgtI0ngznN> AVX Automotive MLCC <https://www.mouser.com/datasheet/2/40/AutoMLCC-777028.pdf> KEMET X7R Series <https://www.mouser.com/datasheet/2/212/KEM_C1002_X7R_SMD-1102033.pdf>; CAPACITANCE: 4.7µF; DKPN: 1276-1044-1-ND; MANUFACTURER: Samsung Electro-Mechanics; MOPN: 187-CL10A475KP8NNNC; MPN: CL10A475KP8NNNC; TOLERANCE: 10%; VOLTAGE: 10V
C8 C37 = HyTechDevices:CAPACITOR_?_*: Capacitor, Non-Polarized VJ...1BC Series Datasheet <https://www.mouser.com/datasheet/2/427/vjw1bcbascomseries-1762447.pdf> Samsung Datasheet <https://www.mouser.com/datasheet/2/585/MLCC-1837944.pdf> Walsin Datasheet <https://www.mouser.com/datasheet/2/210/WTC_MLCC_General_Purpose-1534899.pdf> GRM188R61A226ME15D <https://www.mouser.com/datasheet/2/281/1/GRM188R61A226ME15_02A-1985787.pdf> GRM188R61E106MA73D <https://www.mouser.com/datasheet/2/281/1/GRM188R61E106MA73_01A-1985806.pdf> 885012006013 <https://www.mouser.com/datasheet/2/445/885012006013-1726946.pdf> 2220Y6300105KXTWS2 <https://www.mouser.com/datasheet/2/218/SMD_High_and_Std_StackiCap_P62-1825512.pdf> Yageo Class 2, X5R <https://www.mouser.com/datasheet/2/447/UPY_GPHC_X5R_4V_to_50V_26-1827097.pdf> TDK C Series <https://www.mouser.com/ProductDetail/TDK/C3216X5R1V226M160AC?qs=%2Fha2pyFadujbcx9jh7lYl%2F4NeMoXFhdc8AqVWNq4wW6M2y7zl6GzBuhgtI0ngznN> AVX Automotive MLCC <https://www.mouser.com/datasheet/2/40/AutoMLCC-777028.pdf> KEMET X7R Series <https://www.mouser.com/datasheet/2/212/KEM_C1002_X7R_SMD-1102033.pdf>; CAPACITANCE: 0.1µF; DKPN: 1276-1006-1-ND; MANUFACTURER: Samsung Electro-Mechanics; MOPN: 187-CL10B104KA8NNNC; MPN: CL10B104KA8NNNC; TOLERANCE: 10%; VOLTAGE: 25V
C24 C25 C30 = HyTechDevices:CAPACITOR_?_*: Capacitor, Non-Polarized VJ...1BC Series Datasheet <https://www.mouser.com/datasheet/2/427/vjw1bcbascomseries-1762447.pdf> Samsung Datasheet <https://www.mouser.com/datasheet/2/585/MLCC-1837944.pdf> Walsin Datasheet <https://www.mouser.com/datasheet/2/210/WTC_MLCC_General_Purpose-1534899.pdf> GRM188R61A226ME15D <https://www.mouser.com/datasheet/2/281/1/GRM188R61A226ME15_02A-1985787.pdf> GRM188R61E106MA73D <https://www.mouser.com/datasheet/2/281/1/GRM188R61E106MA73_01A-1985806.pdf> 885012006013 <https://www.mouser.com/datasheet/2/445/885012006013-1726946.pdf> 2220Y6300105KXTWS2 <https://www.mouser.com/datasheet/2/218/SMD_High_and_Std_StackiCap_P62-1825512.pdf> Yageo Class 2, X5R <https://www.mouser.com/datasheet/2/447/UPY_GPHC_X5R_4V_to_50V_26-1827097.pdf> TDK C Series <https://www.mouser.com/ProductDetail/TDK/C3216X5R1V226M160AC?qs=%2Fha2pyFadujbcx9jh7lYl%2F4NeMoXFhdc8AqVWNq4wW6M2y7zl6GzBuhgtI0ngznN> AVX Automotive MLCC <https://www.mouser.com/datasheet/2/40/AutoMLCC-777028.pdf> KEMET X7R Series <https://www.mouser.com/datasheet/2/212/KEM_C1002_X7R_SMD-1102033.pdf>; CAPACITANCE: 1µF; DKPN: 1608-2220Y6300105KXTWS2CT-ND; MANUFACTURER: Knowles Syfer; MOPN: 843-2220Y63105KXTWS2; MPN: 2220Y6300105KXTWS2; TOLERANCE: 10%; VOLTAGE: 630V
C26 = HyTechDevices:CAPACITOR_POLAR_?_*; CAPACITANCE: 3600uF; DKPN: 565-EKYC250ELL362ML20S-ND; MANUFACTURER: United Chemi-con; MOPN: 661-YC250ELL362ML20S; MPN: EKYC250ELL362ML20S; VOLTAGE: 25V
C27 = HyTechDevices:CAPACITOR_?_*: Capacitor, Non-Polarized VJ...1BC Series Datasheet <https://www.mouser.com/datasheet/2/427/vjw1bcbascomseries-1762447.pdf> Samsung Datasheet <https://www.mouser.com/datasheet/2/585/MLCC-1837944.pdf> Walsin Datasheet <https://www.mouser.com/datasheet/2/210/WTC_MLCC_General_Purpose-1534899.pdf> GRM188R61A226ME15D <https://www.mouser.com/datasheet/2/281/1/GRM188R61A226ME15_02A-1985787.pdf> GRM188R61E106MA73D <https://www.mouser.com/datasheet/2/281/1/GRM188R61E106MA73_01A-1985806.pdf> 885012006013 <https://www.mouser.com/datasheet/2/445/885012006013-1726946.pdf> 2220Y6300105KXTWS2 <https://www.mouser.com/datasheet/2/218/SMD_High_and_Std_StackiCap_P62-1825512.pdf> Yageo Class 2, X5R <https://www.mouser.com/datasheet/2/447/UPY_GPHC_X5R_4V_to_50V_26-1827097.pdf> TDK C Series <https://www.mouser.com/ProductDetail/TDK/C3216X5R1V226M160AC?qs=%2Fha2pyFadujbcx9jh7lYl%2F4NeMoXFhdc8AqVWNq4wW6M2y7zl6GzBuhgtI0ngznN> AVX Automotive MLCC <https://www.mouser.com/datasheet/2/40/AutoMLCC-777028.pdf> KEMET X7R Series <https://www.mouser.com/datasheet/2/212/KEM_C1002_X7R_SMD-1102033.pdf>; CAPACITANCE: 10µF; DKPN: 490-7202-1-ND; MANUFACTURER: Murata Electronics; MOPN: 81-GRM188R61E106MA3D; MPN: GRM188R61E106MA73D; TOLERANCE: 20%; VOLTAGE: 25V
C29 = HyTechDevices:CAPACITOR_?_*: Capacitor, Non-Polarized VJ...1BC Series Datasheet <https://www.mouser.com/datasheet/2/427/vjw1bcbascomseries-1762447.pdf> Samsung Datasheet <https://www.mouser.com/datasheet/2/585/MLCC-1837944.pdf> Walsin Datasheet <https://www.mouser.com/datasheet/2/210/WTC_MLCC_General_Purpose-1534899.pdf> GRM188R61A226ME15D <https://www.mouser.com/datasheet/2/281/1/GRM188R61A226ME15_02A-1985787.pdf> GRM188R61E106MA73D <https://www.mouser.com/datasheet/2/281/1/GRM188R61E106MA73_01A-1985806.pdf> 885012006013 <https://www.mouser.com/datasheet/2/445/885012006013-1726946.pdf> 2220Y6300105KXTWS2 <https://www.mouser.com/datasheet/2/218/SMD_High_and_Std_StackiCap_P62-1825512.pdf> Yageo Class 2, X5R <https://www.mouser.com/datasheet/2/447/UPY_GPHC_X5R_4V_to_50V_26-1827097.pdf> TDK C Series <https://www.mouser.com/ProductDetail/TDK/C3216X5R1V226M160AC?qs=%2Fha2pyFadujbcx9jh7lYl%2F4NeMoXFhdc8AqVWNq4wW6M2y7zl6GzBuhgtI0ngznN> AVX Automotive MLCC <https://www.mouser.com/datasheet/2/40/AutoMLCC-777028.pdf> KEMET X7R Series <https://www.mouser.com/datasheet/2/212/KEM_C1002_X7R_SMD-1102033.pdf>; CAPACITANCE: 0.1µF; DKPN: 587-3354-1-ND; MANUFACTURER: Taiyo Yuden; MOPN: 963-GMK107B7104KAHT; MPN: GMK107B7104KAHT; TOLERANCE: 10%; VOLTAGE: 35V
C31-C33 = HyTechDevices:CAPACITOR_?_*: Capacitor, Non-Polarized VJ...1BC Series Datasheet <https://www.mouser.com/datasheet/2/427/vjw1bcbascomseries-1762447.pdf> Samsung Datasheet <https://www.mouser.com/datasheet/2/585/MLCC-1837944.pdf> Walsin Datasheet <https://www.mouser.com/datasheet/2/210/WTC_MLCC_General_Purpose-1534899.pdf> GRM188R61A226ME15D <https://www.mouser.com/datasheet/2/281/1/GRM188R61A226ME15_02A-1985787.pdf> GRM188R61E106MA73D <https://www.mouser.com/datasheet/2/281/1/GRM188R61E106MA73_01A-1985806.pdf> 885012006013 <https://www.mouser.com/datasheet/2/445/885012006013-1726946.pdf> 2220Y6300105KXTWS2 <https://www.mouser.com/datasheet/2/218/SMD_High_and_Std_StackiCap_P62-1825512.pdf> Yageo Class 2, X5R <https://www.mouser.com/datasheet/2/447/UPY_GPHC_X5R_4V_to_50V_26-1827097.pdf> TDK C Series <https://www.mouser.com/ProductDetail/TDK/C3216X5R1V226M160AC?qs=%2Fha2pyFadujbcx9jh7lYl%2F4NeMoXFhdc8AqVWNq4wW6M2y7zl6GzBuhgtI0ngznN> AVX Automotive MLCC <https://www.mouser.com/datasheet/2/40/AutoMLCC-777028.pdf> KEMET X7R Series <https://www.mouser.com/datasheet/2/212/KEM_C1002_X7R_SMD-1102033.pdf>; CAPACITANCE: 1µF; DKPN: 445-2304-2-ND; MANUFACTURER: TDK Corporation; MOPN: 810-C5750X7R2E105K; MPN: C5750X7R2E105K230KA; TOLERANCE: 10%; VOLTAGE: 250V
C34 = HyTechDevices:CAPACITOR_?_*: Capacitor, Non-Polarized VJ...1BC Series Datasheet <https://www.mouser.com/datasheet/2/427/vjw1bcbascomseries-1762447.pdf> Samsung Datasheet <https://www.mouser.com/datasheet/2/585/MLCC-1837944.pdf> Walsin Datasheet <https://www.mouser.com/datasheet/2/210/WTC_MLCC_General_Purpose-1534899.pdf> GRM188R61A226ME15D <https://www.mouser.com/datasheet/2/281/1/GRM188R61A226ME15_02A-1985787.pdf> GRM188R61E106MA73D <https://www.mouser.com/datasheet/2/281/1/GRM188R61E106MA73_01A-1985806.pdf> 885012006013 <https://www.mouser.com/datasheet/2/445/885012006013-1726946.pdf> 2220Y6300105KXTWS2 <https://www.mouser.com/datasheet/2/218/SMD_High_and_Std_StackiCap_P62-1825512.pdf> Yageo Class 2, X5R <https://www.mouser.com/datasheet/2/447/UPY_GPHC_X5R_4V_to_50V_26-1827097.pdf> TDK C Series <https://www.mouser.com/ProductDetail/TDK/C3216X5R1V226M160AC?qs=%2Fha2pyFadujbcx9jh7lYl%2F4NeMoXFhdc8AqVWNq4wW6M2y7zl6GzBuhgtI0ngznN> AVX Automotive MLCC <https://www.mouser.com/datasheet/2/40/AutoMLCC-777028.pdf> KEMET X7R Series <https://www.mouser.com/datasheet/2/212/KEM_C1002_X7R_SMD-1102033.pdf>; CAPACITANCE: 22µF; DKPN: 311-1903-1-ND; MANUFACTURER: Yageo; MOPN: 603-CC805MKX5R8BB226; MPN: CC0805MKX5R8BB226; TOLERANCE: 20%; VOLTAGE: 25V
C35 C48 C49 = HyTechDevices:CAPACITOR_?_*: Capacitor, Non-Polarized VJ...1BC Series Datasheet <https://www.mouser.com/datasheet/2/427/vjw1bcbascomseries-1762447.pdf> Samsung Datasheet <https://www.mouser.com/datasheet/2/585/MLCC-1837944.pdf> Walsin Datasheet <https://www.mouser.com/datasheet/2/210/WTC_MLCC_General_Purpose-1534899.pdf> GRM188R61A226ME15D <https://www.mouser.com/datasheet/2/281/1/GRM188R61A226ME15_02A-1985787.pdf> GRM188R61E106MA73D <https://www.mouser.com/datasheet/2/281/1/GRM188R61E106MA73_01A-1985806.pdf> 885012006013 <https://www.mouser.com/datasheet/2/445/885012006013-1726946.pdf> 2220Y6300105KXTWS2 <https://www.mouser.com/datasheet/2/218/SMD_High_and_Std_StackiCap_P62-1825512.pdf> Yageo Class 2, X5R <https://www.mouser.com/datasheet/2/447/UPY_GPHC_X5R_4V_to_50V_26-1827097.pdf> TDK C Series <https://www.mouser.com/ProductDetail/TDK/C3216X5R1V226M160AC?qs=%2Fha2pyFadujbcx9jh7lYl%2F4NeMoXFhdc8AqVWNq4wW6M2y7zl6GzBuhgtI0ngznN> AVX Automotive MLCC <https://www.mouser.com/datasheet/2/40/AutoMLCC-777028.pdf> KEMET X7R Series <https://www.mouser.com/datasheet/2/212/KEM_C1002_X7R_SMD-1102033.pdf>; CAPACITANCE: 10nF; DKPN: 311-4054-1-ND; MANUFACTURER: Yageo; MOPN: 603-CC603KRX7R6BB103; MPN: CC0603KRX7R6BB103; TOLERANCE: 10%; VOLTAGE: 10V
C38-C41 C44-C47 = HyTechDevices:CAPACITOR_?_*: Capacitor, Non-Polarized VJ...1BC Series Datasheet <https://www.mouser.com/datasheet/2/427/vjw1bcbascomseries-1762447.pdf> Samsung Datasheet <https://www.mouser.com/datasheet/2/585/MLCC-1837944.pdf> Walsin Datasheet <https://www.mouser.com/datasheet/2/210/WTC_MLCC_General_Purpose-1534899.pdf> GRM188R61A226ME15D <https://www.mouser.com/datasheet/2/281/1/GRM188R61A226ME15_02A-1985787.pdf> GRM188R61E106MA73D <https://www.mouser.com/datasheet/2/281/1/GRM188R61E106MA73_01A-1985806.pdf> 885012006013 <https://www.mouser.com/datasheet/2/445/885012006013-1726946.pdf> 2220Y6300105KXTWS2 <https://www.mouser.com/datasheet/2/218/SMD_High_and_Std_StackiCap_P62-1825512.pdf> Yageo Class 2, X5R <https://www.mouser.com/datasheet/2/447/UPY_GPHC_X5R_4V_to_50V_26-1827097.pdf> TDK C Series <https://www.mouser.com/ProductDetail/TDK/C3216X5R1V226M160AC?qs=%2Fha2pyFadujbcx9jh7lYl%2F4NeMoXFhdc8AqVWNq4wW6M2y7zl6GzBuhgtI0ngznN> AVX Automotive MLCC <https://www.mouser.com/datasheet/2/40/AutoMLCC-777028.pdf> KEMET X7R Series <https://www.mouser.com/datasheet/2/212/KEM_C1002_X7R_SMD-1102033.pdf>; CAPACITANCE: 1µF; DKPN: 311-1796-1-ND; MANUFACTURER: Yageo; MOPN: 603-CC603KRX7R6BB105; MPN: CC0603KRX7R6BB105; TOLERANCE: 10%; VOLTAGE: 10V
D1 = HyTechDevices:TVS_*: TVS Diode GSOT Datasheet <https://www.mouser.com/datasheet/2/427/gsot03-1767593.pdf>; DKPN: GSOT08-E3-08TR-ND; MANUFACTURER: Vishay General Semiconductor - Diodes Division; MOPN: 78-GSOT08-E3-08; MPN: GSOT08-E3-08; VOLTAGE: 8V
D2 = HyTechDevices:LED_?_*: LED 0603 Blue <https://www.mouser.com/datasheet/2/216/APT1608VBC_D-246010.pdf> Green <https://www.mouser.com/datasheet/2/216/APT1608ZGCK-1173388.pdf> Orange <https://www.mouser.com/datasheet/2/216/APT1608SECK-6197.pdf> Red <https://www.mouser.com/datasheet/2/216/APT1608SECK-J3-PRV-1173336.pdf> White <https://www.mouser.com/datasheet/2/50/SM0603UWC-880813.pdf> Yellow <https://www.mouser.com/datasheet/2/216/APT1608SYCK-J3-PRV-1173311.pdf> 2835 (Series not on Digikey) Lumiled LUXEON 2835 Color Line <https://www.mouser.com/datasheet/2/602/DS236_luxeon_2835_color_line_datasheet-1596094.pdf>; COLOR: White; DKPN: SM0603UWC-ND; MANUFACTURER: Bivar Inc.; MOPN: 749-SM0603UWC; MPN: SM0603UWC
D3 = HyTechDevices:LED_?_*: LED 0603 Blue <https://www.mouser.com/datasheet/2/216/APT1608VBC_D-246010.pdf> Green <https://www.mouser.com/datasheet/2/216/APT1608ZGCK-1173388.pdf> Orange <https://www.mouser.com/datasheet/2/216/APT1608SECK-6197.pdf> Red <https://www.mouser.com/datasheet/2/216/APT1608SECK-J3-PRV-1173336.pdf> White <https://www.mouser.com/datasheet/2/50/SM0603UWC-880813.pdf> Yellow <https://www.mouser.com/datasheet/2/216/APT1608SYCK-J3-PRV-1173311.pdf> 2835 (Series not on Digikey) Lumiled LUXEON 2835 Color Line <https://www.mouser.com/datasheet/2/602/DS236_luxeon_2835_color_line_datasheet-1596094.pdf>; COLOR: Green; DKPN: 754-1790-1-ND; MANUFACTURER: Kingbright; MOPN: 604-APT1608ZGCK; MPN: APT1608ZGCK
D4 = HyTechDevices:LED_?_*: LED 0603 Blue <https://www.mouser.com/datasheet/2/216/APT1608VBC_D-246010.pdf> Green <https://www.mouser.com/datasheet/2/216/APT1608ZGCK-1173388.pdf> Orange <https://www.mouser.com/datasheet/2/216/APT1608SECK-6197.pdf> Red <https://www.mouser.com/datasheet/2/216/APT1608SECK-J3-PRV-1173336.pdf> White <https://www.mouser.com/datasheet/2/50/SM0603UWC-880813.pdf> Yellow <https://www.mouser.com/datasheet/2/216/APT1608SYCK-J3-PRV-1173311.pdf> 2835 (Series not on Digikey) Lumiled LUXEON 2835 Color Line <https://www.mouser.com/datasheet/2/602/DS236_luxeon_2835_color_line_datasheet-1596094.pdf>; COLOR: Yellow; DKPN: 754-1788-1-ND; MANUFACTURER: Kingbright; MOPN: 604-APT1608SYCK/J3-PRV; MPN: APT1608SYCK/J3-PRV
D5 D9 D11 D13 = HyTechDevices:LED_?_*: LED 0603 Blue <https://www.mouser.com/datasheet/2/216/APT1608VBC_D-246010.pdf> Green <https://www.mouser.com/datasheet/2/216/APT1608ZGCK-1173388.pdf> Orange <https://www.mouser.com/datasheet/2/216/APT1608SECK-6197.pdf> Red <https://www.mouser.com/datasheet/2/216/APT1608SECK-J3-PRV-1173336.pdf> White <https://www.mouser.com/datasheet/2/50/SM0603UWC-880813.pdf> Yellow <https://www.mouser.com/datasheet/2/216/APT1608SYCK-J3-PRV-1173311.pdf> 2835 (Series not on Digikey) Lumiled LUXEON 2835 Color Line <https://www.mouser.com/datasheet/2/602/DS236_luxeon_2835_color_line_datasheet-1596094.pdf>; COLOR: Blue; DKPN: 754-1789-1-ND; MANUFACTURER: Kingbright; MOPN: 604-APT1608VBC/D; MPN: APT1608VBC/D
D6 = HyTechDevices:LED_?_*: LED 0603 Blue <https://www.mouser.com/datasheet/2/216/APT1608VBC_D-246010.pdf> Green <https://www.mouser.com/datasheet/2/216/APT1608ZGCK-1173388.pdf> Orange <https://www.mouser.com/datasheet/2/216/APT1608SECK-6197.pdf> Red <https://www.mouser.com/datasheet/2/216/APT1608SECK-J3-PRV-1173336.pdf> White <https://www.mouser.com/datasheet/2/50/SM0603UWC-880813.pdf> Yellow <https://www.mouser.com/datasheet/2/216/APT1608SYCK-J3-PRV-1173311.pdf> 2835 (Series not on Digikey) Lumiled LUXEON 2835 Color Line <https://www.mouser.com/datasheet/2/602/DS236_luxeon_2835_color_line_datasheet-1596094.pdf>; COLOR: Red; DKPN: 754-1786-1-ND; MANUFACTURER: Kingbright; MOPN: 604-APT1608SECKJ3PRV; MPN: APT1608SECK/J3-PRV
D7 D8 D10 = HyTechDevices:SCHOTTKY_?_*: CUS08F30 Shottky Diode Datasheet <https://www.mouser.com/datasheet/2/408/CUS08F30_datasheet_en_20140414-1916097.pdf>; CURRENT: 0.8A; DKPN: CUS08F30H3FTR-ND; MANUFACTURER: Toshiba Semiconductor and Storage; MOPN: 757-CUS08F30H3F; MPN: CUS08F30; VOLTAGE: 30V
D12 = HyTechDevices:LED_?_*: LED 0603 Blue <https://www.mouser.com/datasheet/2/216/APT1608VBC_D-246010.pdf> Green <https://www.mouser.com/datasheet/2/216/APT1608ZGCK-1173388.pdf> Orange <https://www.mouser.com/datasheet/2/216/APT1608SECK-6197.pdf> Red <https://www.mouser.com/datasheet/2/216/APT1608SECK-J3-PRV-1173336.pdf> White <https://www.mouser.com/datasheet/2/50/SM0603UWC-880813.pdf> Yellow <https://www.mouser.com/datasheet/2/216/APT1608SYCK-J3-PRV-1173311.pdf> 2835 (Series not on Digikey) Lumiled LUXEON 2835 Color Line <https://www.mouser.com/datasheet/2/602/DS236_luxeon_2835_color_line_datasheet-1596094.pdf>; COLOR: Orange; DKPN: 754-1120-1-ND; MANUFACTURER: Kingbright; MOPN: 604-APT1608SECK; MPN: APT1608SECK
D14 = HyTechDevicesTempTSB:RECTIFIER_*_?; CURRENT: 1A; DKPN: US1GWF-7DITR-ND; MANUFACTURER: Diodes Incorporated; MOPN: 621-US1GWF-7; MPN: US1GWF-7; VOLTAGE: 400V
F2 F6 = HyTechDevices:FUSE_?_*: Fuse 0885 Series <https://www.mouser.com/datasheet/2/240/Littelfuse_Fuse_885_Datasheet_pdf-1371443.pdf>; CURRENT: 1.25A; DKPN: F10986CT-ND; MANUFACTURER: Littelfuse Inc.; MOPN: 576-08851.25DR; MPN: 08851.25DR; VOLTAGE: 500V
J1 = HyTechDevices:CONNECTOR-5_?_*; MANUFACTURER: Molex; MPN: 2165713006
J2 = HyTechDevices:CONNECTOR-5_?_*; MANUFACTURER: Molex; MPN: 2165713007
J3 = HyTechDevices:CONNECTOR-8_?_*: 8 Pin Connector; DKPN: S7107-ND; MANUFACTURER: Sullins Connector Solutions; MPN: PPPC042LFBN-RC
J5 = HyTechDevices:CONNECTOR-4_?_*; MANUFACTURER: Molex; MPN: 2068320423
K4 = HyTechDevices:RELAY_SPST_NC_POLARIZED_?*: Single Pole, Single Throw Normally Closed Polarized Relay 355x Series <https://www.comus-intl.com/wp-content/uploads/2017/01/High-Voltage-Reed-Relays.pdf> D Series <https://www.mouser.com/datasheet/2/657/cynergy3_d_pcb_v2-1892244.pdf>; DKPN: 1835-1040-ND; MANUFACTURER: Comus International; MPN: 3350-4275-126
K5 = HyTechDevices:RELAY_SPST_NO_?*: Single Pole, Single Throw Relay Normally Open 355x Series <https://www.comus-intl.com/wp-content/uploads/2017/01/High-Voltage-Reed-Relays.pdf> D Series <https://www.mouser.com/datasheet/2/657/cynergy3_d_pcb_v2-1892244.pdf>; DKPN: 1835-1037-ND; MANUFACTURER: Comus International; MPN: 3350-1275-126
L4 = HyTechDevices:INDUCTOR_?_*: Inductor LQM18DH100M70 Datasheet <https://search.murata.co.jp/Ceramy/image/img/P02/JELF243B-9127.pdf> 74451133 Datasheet <https://www.we-online.com/catalog/datasheet/74451133.pdf> SRU1408 Datasheet <https://www.mouser.com/datasheet/2/54/SRU1048-1391431.pdf> PA4334 Datasheet <https://www.mouser.com/datasheet/2/336/plei_s_a0002827602_1-2281222.pdf> WE-LMHI Datasheet <https://www.mouser.com/datasheet/2/445/74437349560-1721693.pdf>; CURRENT_RATED: 1.6A; CURRENT_SATURATION: 1A; DCR: 0.13Ω; DKPN: 553-3508-2-ND; INDUCTANCE: 3.6uH; MANUFACTURER: Pulse Electronics Power; MOPN: 673-PA4334362NLT; MPN: PA4334.362NLT; TOLERANCE: 20%
L5 = HyTechDevices:INDUCTOR_?_*: Inductor LQM18DH100M70 Datasheet <https://search.murata.co.jp/Ceramy/image/img/P02/JELF243B-9127.pdf> 74451133 Datasheet <https://www.we-online.com/catalog/datasheet/74451133.pdf> SRU1408 Datasheet <https://www.mouser.com/datasheet/2/54/SRU1048-1391431.pdf> PA4334 Datasheet <https://www.mouser.com/datasheet/2/336/plei_s_a0002827602_1-2281222.pdf> WE-LMHI Datasheet <https://www.mouser.com/datasheet/2/445/74437349560-1721693.pdf>; CURRENT_RATED: 1.4A; CURRENT_SATURATION: 2A; DCR: 342mΩ; DKPN: 732-11454-2-ND; INDUCTANCE: 56µH; MANUFACTURER: Wurth Elektronik; MOPN: 710-74437349560; MPN: 74437349560; TOLERANCE: 20%
L6 = HyTechDevices:INDUCTOR_?_*: Inductor LQM18DH100M70 Datasheet <https://search.murata.co.jp/Ceramy/image/img/P02/JELF243B-9127.pdf> 74451133 Datasheet <https://www.we-online.com/catalog/datasheet/74451133.pdf> SRU1408 Datasheet <https://www.mouser.com/datasheet/2/54/SRU1048-1391431.pdf> PA4334 Datasheet <https://www.mouser.com/datasheet/2/336/plei_s_a0002827602_1-2281222.pdf> WE-LMHI Datasheet <https://www.mouser.com/datasheet/2/445/74437349560-1721693.pdf>; CURRENT_RATED: 0.65A; CURRENT_SATURATION: 0.52A; DCR: 0.640Ω; DKPN: SRU1048-331YTR-ND; INDUCTANCE: 330µH; MANUFACTURER: Bourns Inc.; MOPN: 652-SRU1048-331Y; MPN: SRU1048-331Y; TOLERANCE: 30%
Q2 = HyTechDevices:TRANSISTOR_N_MOS_?_*: N-MOSFET PMV15ENEA Datasheet <https://www.mouser.com/datasheet/2/916/PMV15ENEA-1604828.pdf> TK6P65W Datasheet <https://www.mouser.com/datasheet/2/408/TK6P65W_datasheet_en_20151225-1916290.pdf> SIR638ADP Datasheet <https://www.mouser.com/datasheet/2/427/sir638adp-1766131.pdf>; DKPN: 1727-8588-1-ND; MANUFACTURER: Nexperia USA Inc.; MOPN: 771-PMV15ENEAR; MPN: PMV15ENEAR
R1 R10 = HyTechDevices:RESISTOR_?_*: Resistor PWR163 Series <https://www.mouser.com/datasheet/2/54/pwr163-777985.pdf> AC Series <https://www.mouser.com/datasheet/2/447/Yageo_PYu_AC_51_RoHS_L_7_1714230-1874691.pdf> PU Series <https://www.mouser.com/datasheet/2/447/PYu-PU_51_RoHS_L_6-1504619.pdf> ERA Series <https://www.mouser.com/datasheet/2/315/AOA0000C307-1149632.pdf> PWR263 Series <https://www.mouser.com/datasheet/2/54/pwr263s_35-778069.pdf> KTR Series <https://www.mouser.com/datasheet/2/348/ROHM_S_A0011075115_1-2563276.pdf> RC Series <https://www.mouser.com/datasheet/2/447/Yageo_03_18_2021_PYu_RC_Group_51_RoHS_L_11-2199992.pdf> ERJ PB3, PB6 Series <https://www.mouser.com/datasheet/2/315/AOA0000C328-1530132.pdf> ERJ PA2, P03, PA3, P06, P08, P14 Series <https://www.mouser.com/datasheet/2/315/AOA0000C331-1141874.pdf>; DKPN: RHM360KAYTR-ND; MANUFACTURER: Rohm Semiconductor; MOPN: 755-KTR03EZPF3603; MPN: KTR03EZPF3603; POWER: 0.1W; RESISTANCE: 360k; TOLERANCE: 1%; VOLTAGE_CONTINUOUS: 190V; VOLTAGE_MAX: 350V
R2 R11 = HyTechDevices:RESISTOR_?_*: Resistor PWR163 Series <https://www.mouser.com/datasheet/2/54/pwr163-777985.pdf> AC Series <https://www.mouser.com/datasheet/2/447/Yageo_PYu_AC_51_RoHS_L_7_1714230-1874691.pdf> PU Series <https://www.mouser.com/datasheet/2/447/PYu-PU_51_RoHS_L_6-1504619.pdf> ERA Series <https://www.mouser.com/datasheet/2/315/AOA0000C307-1149632.pdf> PWR263 Series <https://www.mouser.com/datasheet/2/54/pwr263s_35-778069.pdf> KTR Series <https://www.mouser.com/datasheet/2/348/ROHM_S_A0011075115_1-2563276.pdf> RC Series <https://www.mouser.com/datasheet/2/447/Yageo_03_18_2021_PYu_RC_Group_51_RoHS_L_11-2199992.pdf> ERJ PB3, PB6 Series <https://www.mouser.com/datasheet/2/315/AOA0000C328-1530132.pdf> ERJ PA2, P03, PA3, P06, P08, P14 Series <https://www.mouser.com/datasheet/2/315/AOA0000C331-1141874.pdf>; DKPN: RHM510KAYTR-ND; MANUFACTURER: Rohm Semiconductor; MOPN: 755-KTR03EZPF5103; MPN: KTR03EZPF5103; POWER: 0.1W; RESISTANCE: 510k; TOLERANCE: 1%; VOLTAGE_CONTINUOUS: 226V; VOLTAGE_MAX: 350V
R3 = HyTechDevices:RESISTOR_?_*: Resistor PWR163 Series <https://www.mouser.com/datasheet/2/54/pwr163-777985.pdf> AC Series <https://www.mouser.com/datasheet/2/447/Yageo_PYu_AC_51_RoHS_L_7_1714230-1874691.pdf> PU Series <https://www.mouser.com/datasheet/2/447/PYu-PU_51_RoHS_L_6-1504619.pdf> ERA Series <https://www.mouser.com/datasheet/2/315/AOA0000C307-1149632.pdf> PWR263 Series <https://www.mouser.com/datasheet/2/54/pwr263s_35-778069.pdf> KTR Series <https://www.mouser.com/datasheet/2/348/ROHM_S_A0011075115_1-2563276.pdf> RC Series <https://www.mouser.com/datasheet/2/447/Yageo_03_18_2021_PYu_RC_Group_51_RoHS_L_11-2199992.pdf> ERJ PB3, PB6 Series <https://www.mouser.com/datasheet/2/315/AOA0000C328-1530132.pdf> ERJ PA2, P03, PA3, P06, P08, P14 Series <https://www.mouser.com/datasheet/2/315/AOA0000C331-1141874.pdf>; DKPN: YAG4603TR-ND; MANUFACTURER: Yageo; MOPN: 603-RT0603BRD078K66L; MPN: RT0603BRD078K66L; POWER: 0.1W; RESISTANCE: 8.66k; TOLERANCE: 0.1%; VOLTAGE_CONTINUOUS: 29.43V; VOLTAGE_MAX: 75V
R4 = HyTechDevices:RESISTOR_?_*: Resistor PWR163 Series <https://www.mouser.com/datasheet/2/54/pwr163-777985.pdf> AC Series <https://www.mouser.com/datasheet/2/447/Yageo_PYu_AC_51_RoHS_L_7_1714230-1874691.pdf> PU Series <https://www.mouser.com/datasheet/2/447/PYu-PU_51_RoHS_L_6-1504619.pdf> ERA Series <https://www.mouser.com/datasheet/2/315/AOA0000C307-1149632.pdf> PWR263 Series <https://www.mouser.com/datasheet/2/54/pwr263s_35-778069.pdf> KTR Series <https://www.mouser.com/datasheet/2/348/ROHM_S_A0011075115_1-2563276.pdf> RC Series <https://www.mouser.com/datasheet/2/447/Yageo_03_18_2021_PYu_RC_Group_51_RoHS_L_11-2199992.pdf> ERJ PB3, PB6 Series <https://www.mouser.com/datasheet/2/315/AOA0000C328-1530132.pdf> ERJ PA2, P03, PA3, P06, P08, P14 Series <https://www.mouser.com/datasheet/2/315/AOA0000C331-1141874.pdf>; DKPN: P20098TR-ND; MANUFACTURER: Panasonic Electronic Components; MOPN: 667-ERJ-PB3B1302V; MPN: ERJ-PB3B1302V; POWER: 0.1W; RESISTANCE: 13k; TOLERANCE: 0.1%; VOLTAGE_CONTINUOUS: 36V
R5 = HyTechDevices:RESISTOR_?_*: Resistor PWR163 Series <https://www.mouser.com/datasheet/2/54/pwr163-777985.pdf> AC Series <https://www.mouser.com/datasheet/2/447/Yageo_PYu_AC_51_RoHS_L_7_1714230-1874691.pdf> PU Series <https://www.mouser.com/datasheet/2/447/PYu-PU_51_RoHS_L_6-1504619.pdf> ERA Series <https://www.mouser.com/datasheet/2/315/AOA0000C307-1149632.pdf> PWR263 Series <https://www.mouser.com/datasheet/2/54/pwr263s_35-778069.pdf> KTR Series <https://www.mouser.com/datasheet/2/348/ROHM_S_A0011075115_1-2563276.pdf> RC Series <https://www.mouser.com/datasheet/2/447/Yageo_03_18_2021_PYu_RC_Group_51_RoHS_L_11-2199992.pdf> ERJ PB3, PB6 Series <https://www.mouser.com/datasheet/2/315/AOA0000C328-1530132.pdf> ERJ PA2, P03, PA3, P06, P08, P14 Series <https://www.mouser.com/datasheet/2/315/AOA0000C331-1141874.pdf>; DKPN: P20935TR-ND; MANUFACTURER: Panasonic Electronic Components; MOPN: 667-ERJ-PB6B9763V; MPN: ERJ-PB6B9763V; POWER: 0.25W; RESISTANCE: 976k; TOLERANCE: 0.1%; VOLTAGE_CONTINUOUS: 150V; VOLTAGE_MAX: 150V
R6-R9 = HyTechDevices:RESISTOR_?_*: Resistor PWR163 Series <https://www.mouser.com/datasheet/2/54/pwr163-777985.pdf> AC Series <https://www.mouser.com/datasheet/2/447/Yageo_PYu_AC_51_RoHS_L_7_1714230-1874691.pdf> PU Series <https://www.mouser.com/datasheet/2/447/PYu-PU_51_RoHS_L_6-1504619.pdf> ERA Series <https://www.mouser.com/datasheet/2/315/AOA0000C307-1149632.pdf> PWR263 Series <https://www.mouser.com/datasheet/2/54/pwr263s_35-778069.pdf> KTR Series <https://www.mouser.com/datasheet/2/348/ROHM_S_A0011075115_1-2563276.pdf> RC Series <https://www.mouser.com/datasheet/2/447/Yageo_03_18_2021_PYu_RC_Group_51_RoHS_L_11-2199992.pdf> ERJ PB3, PB6 Series <https://www.mouser.com/datasheet/2/315/AOA0000C328-1530132.pdf> ERJ PA2, P03, PA3, P06, P08, P14 Series <https://www.mouser.com/datasheet/2/315/AOA0000C331-1141874.pdf>; DKPN: RHM33KAYTR-ND; MANUFACTURER: Rohm Semiconductor; MOPN: 755-KTR03EZPF3302; MPN: KTR03EZPF3302; POWER: 0.1W; RESISTANCE: 33k; TOLERANCE: 1%; VOLTAGE_CONTINUOUS: 57.4V; VOLTAGE_MAX: 350V
R16-R18 = HyTechDevices:RESISTOR_?_*: Resistor PWR163 Series <https://www.mouser.com/datasheet/2/54/pwr163-777985.pdf> AC Series <https://www.mouser.com/datasheet/2/447/Yageo_PYu_AC_51_RoHS_L_7_1714230-1874691.pdf> PU Series <https://www.mouser.com/datasheet/2/447/PYu-PU_51_RoHS_L_6-1504619.pdf> ERA Series <https://www.mouser.com/datasheet/2/315/AOA0000C307-1149632.pdf> PWR263 Series <https://www.mouser.com/datasheet/2/54/pwr263s_35-778069.pdf> KTR Series <https://www.mouser.com/datasheet/2/348/ROHM_S_A0011075115_1-2563276.pdf> RC Series <https://www.mouser.com/datasheet/2/447/Yageo_03_18_2021_PYu_RC_Group_51_RoHS_L_11-2199992.pdf> ERJ PB3, PB6 Series <https://www.mouser.com/datasheet/2/315/AOA0000C328-1530132.pdf> ERJ PA2, P03, PA3, P06, P08, P14 Series <https://www.mouser.com/datasheet/2/315/AOA0000C331-1141874.pdf>; DKPN: B20J10KE-ND; MANUFACTURER: Ohmite; MOPN: 588-B20J10KE; MPN: B20J10KE; POWER: 20W; RESISTANCE: 10k; TOLERANCE: 5%; VOLTAGE_CONTINUOUS: 447V; VOLTAGE_MAX: 750V
R19 = HyTechDevices:RESISTOR_?_*: Resistor PWR163 Series <https://www.mouser.com/datasheet/2/54/pwr163-777985.pdf> AC Series <https://www.mouser.com/datasheet/2/447/Yageo_PYu_AC_51_RoHS_L_7_1714230-1874691.pdf> PU Series <https://www.mouser.com/datasheet/2/447/PYu-PU_51_RoHS_L_6-1504619.pdf> ERA Series <https://www.mouser.com/datasheet/2/315/AOA0000C307-1149632.pdf> PWR263 Series <https://www.mouser.com/datasheet/2/54/pwr263s_35-778069.pdf> KTR Series <https://www.mouser.com/datasheet/2/348/ROHM_S_A0011075115_1-2563276.pdf> RC Series <https://www.mouser.com/datasheet/2/447/Yageo_03_18_2021_PYu_RC_Group_51_RoHS_L_11-2199992.pdf> ERJ PB3, PB6 Series <https://www.mouser.com/datasheet/2/315/AOA0000C328-1530132.pdf> ERJ PA2, P03, PA3, P06, P08, P14 Series <https://www.mouser.com/datasheet/2/315/AOA0000C331-1141874.pdf>; DKPN: B20J750E-ND; MANUFACTURER: Ohmite; MOPN: 588-B20J750E; MPN: B20J750E; POWER: 20W; RESISTANCE: 750; TOLERANCE: 5%; VOLTAGE_CONTINUOUS: 122V; VOLTAGE_MAX: 750V
R26 R27 = HyTechDevices:RESISTOR_?_*: Resistor PWR163 Series <https://www.mouser.com/datasheet/2/54/pwr163-777985.pdf> AC Series <https://www.mouser.com/datasheet/2/447/Yageo_PYu_AC_51_RoHS_L_7_1714230-1874691.pdf> PU Series <https://www.mouser.com/datasheet/2/447/PYu-PU_51_RoHS_L_6-1504619.pdf> ERA Series <https://www.mouser.com/datasheet/2/315/AOA0000C307-1149632.pdf> PWR263 Series <https://www.mouser.com/datasheet/2/54/pwr263s_35-778069.pdf> KTR Series <https://www.mouser.com/datasheet/2/348/ROHM_S_A0011075115_1-2563276.pdf> RC Series <https://www.mouser.com/datasheet/2/447/Yageo_03_18_2021_PYu_RC_Group_51_RoHS_L_11-2199992.pdf> ERJ PB3, PB6 Series <https://www.mouser.com/datasheet/2/315/AOA0000C328-1530132.pdf> ERJ PA2, P03, PA3, P06, P08, P14 Series <https://www.mouser.com/datasheet/2/315/AOA0000C331-1141874.pdf>; DKPN: P3.3AJTR-ND; MANUFACTURER: Panasonic Electronic Components; MOPN: 667-ERJ-3RQF3R3V; MPN: ERJ-3RQF3R3V; POWER: 0.1W; RESISTANCE: 3.3; TOLERANCE: 1%; VOLTAGE_CONTINUOUS: 0.57V; VOLTAGE_MAX: 75V
R28-R30 R32 R34-R36 R52-R55 R63 = HyTechDevices:RESISTOR_?_*: Resistor PWR163 Series <https://www.mouser.com/datasheet/2/54/pwr163-777985.pdf> AC Series <https://www.mouser.com/datasheet/2/447/Yageo_PYu_AC_51_RoHS_L_7_1714230-1874691.pdf> PU Series <https://www.mouser.com/datasheet/2/447/PYu-PU_51_RoHS_L_6-1504619.pdf> ERA Series <https://www.mouser.com/datasheet/2/315/AOA0000C307-1149632.pdf> PWR263 Series <https://www.mouser.com/datasheet/2/54/pwr263s_35-778069.pdf> KTR Series <https://www.mouser.com/datasheet/2/348/ROHM_S_A0011075115_1-2563276.pdf> RC Series <https://www.mouser.com/datasheet/2/447/Yageo_03_18_2021_PYu_RC_Group_51_RoHS_L_11-2199992.pdf> ERJ PB3, PB6 Series <https://www.mouser.com/datasheet/2/315/AOA0000C328-1530132.pdf> ERJ PA2, P03, PA3, P06, P08, P14 Series <https://www.mouser.com/datasheet/2/315/AOA0000C331-1141874.pdf>; DKPN: 311-1.00KHRCT-ND; MANUFACTURER: Yageo; MOPN: 603-RC0603FR-071KL; MPN: RC0603FR-071KL; POWER: 0.1W; RESISTANCE: 1k; TOLERANCE: 1%; VOLTAGE_CONTINUOUS: 10.00V; VOLTAGE_MAX: 75V
R31 = HyTechDevices:RESISTOR_?_*: Resistor PWR163 Series <https://www.mouser.com/datasheet/2/54/pwr163-777985.pdf> AC Series <https://www.mouser.com/datasheet/2/447/Yageo_PYu_AC_51_RoHS_L_7_1714230-1874691.pdf> PU Series <https://www.mouser.com/datasheet/2/447/PYu-PU_51_RoHS_L_6-1504619.pdf> ERA Series <https://www.mouser.com/datasheet/2/315/AOA0000C307-1149632.pdf> PWR263 Series <https://www.mouser.com/datasheet/2/54/pwr263s_35-778069.pdf> KTR Series <https://www.mouser.com/datasheet/2/348/ROHM_S_A0011075115_1-2563276.pdf> RC Series <https://www.mouser.com/datasheet/2/447/Yageo_03_18_2021_PYu_RC_Group_51_RoHS_L_11-2199992.pdf> ERJ PB3, PB6 Series <https://www.mouser.com/datasheet/2/315/AOA0000C328-1530132.pdf> ERJ PA2, P03, PA3, P06, P08, P14 Series <https://www.mouser.com/datasheet/2/315/AOA0000C331-1141874.pdf>; DKPN: 1712-CPF0603B1R62E1TR-ND; MANUFACTURER: TE Conductivity Passive Product; MOPN: 279-CPF0603B1R62E1; MPN: CPF0603B1R62E1; POWER: 0.1W; RESISTANCE: 1.62; TOLERANCE: 0.1%; VOLTAGE_CONTINUOUS: 0.51V; VOLTAGE_MAX: 50V
R33 = HyTechDevices:RESISTOR_?_*: Resistor PWR163 Series <https://www.mouser.com/datasheet/2/54/pwr163-777985.pdf> AC Series <https://www.mouser.com/datasheet/2/447/Yageo_PYu_AC_51_RoHS_L_7_1714230-1874691.pdf> PU Series <https://www.mouser.com/datasheet/2/447/PYu-PU_51_RoHS_L_6-1504619.pdf> ERA Series <https://www.mouser.com/datasheet/2/315/AOA0000C307-1149632.pdf> PWR263 Series <https://www.mouser.com/datasheet/2/54/pwr263s_35-778069.pdf> KTR Series <https://www.mouser.com/datasheet/2/348/ROHM_S_A0011075115_1-2563276.pdf> RC Series <https://www.mouser.com/datasheet/2/447/Yageo_03_18_2021_PYu_RC_Group_51_RoHS_L_11-2199992.pdf> ERJ PB3, PB6 Series <https://www.mouser.com/datasheet/2/315/AOA0000C328-1530132.pdf> ERJ PA2, P03, PA3, P06, P08, P14 Series <https://www.mouser.com/datasheet/2/315/AOA0000C331-1141874.pdf>; RESISTANCE: DNP
R37 = HyTechDevices:RESISTOR_?_*: Resistor PWR163 Series <https://www.mouser.com/datasheet/2/54/pwr163-777985.pdf> AC Series <https://www.mouser.com/datasheet/2/447/Yageo_PYu_AC_51_RoHS_L_7_1714230-1874691.pdf> PU Series <https://www.mouser.com/datasheet/2/447/PYu-PU_51_RoHS_L_6-1504619.pdf> ERA Series <https://www.mouser.com/datasheet/2/315/AOA0000C307-1149632.pdf> PWR263 Series <https://www.mouser.com/datasheet/2/54/pwr263s_35-778069.pdf> KTR Series <https://www.mouser.com/datasheet/2/348/ROHM_S_A0011075115_1-2563276.pdf> RC Series <https://www.mouser.com/datasheet/2/447/Yageo_03_18_2021_PYu_RC_Group_51_RoHS_L_11-2199992.pdf> ERJ PB3, PB6 Series <https://www.mouser.com/datasheet/2/315/AOA0000C328-1530132.pdf> ERJ PA2, P03, PA3, P06, P08, P14 Series <https://www.mouser.com/datasheet/2/315/AOA0000C331-1141874.pdf>; DKPN: 311-10.0HRCT-ND; MANUFACTURER: Yageo; MOPN: 603-RC0603FR-0710RL; MPN: RC0603FR-0710RL; POWER: 0.1W; RESISTANCE: 10; TOLERANCE: 1%; VOLTAGE_CONTINUOUS: 1V; VOLTAGE_MAX: 75V
R38 R47 = HyTechDevices:RESISTOR_?_*: Resistor PWR163 Series <https://www.mouser.com/datasheet/2/54/pwr163-777985.pdf> AC Series <https://www.mouser.com/datasheet/2/447/Yageo_PYu_AC_51_RoHS_L_7_1714230-1874691.pdf> PU Series <https://www.mouser.com/datasheet/2/447/PYu-PU_51_RoHS_L_6-1504619.pdf> ERA Series <https://www.mouser.com/datasheet/2/315/AOA0000C307-1149632.pdf> PWR263 Series <https://www.mouser.com/datasheet/2/54/pwr263s_35-778069.pdf> KTR Series <https://www.mouser.com/datasheet/2/348/ROHM_S_A0011075115_1-2563276.pdf> RC Series <https://www.mouser.com/datasheet/2/447/Yageo_03_18_2021_PYu_RC_Group_51_RoHS_L_11-2199992.pdf> ERJ PB3, PB6 Series <https://www.mouser.com/datasheet/2/315/AOA0000C328-1530132.pdf> ERJ PA2, P03, PA3, P06, P08, P14 Series <https://www.mouser.com/datasheet/2/315/AOA0000C331-1141874.pdf>; DKPN: 311-10.0KHRCT-ND; MANUFACTURER: Yageo; MOPN: 603-RC0603FR-0710KL; MPN: RC0603FR-0710KL; POWER: 0.1W; RESISTANCE: 10k; TOLERANCE: 1%; VOLTAGE_CONTINUOUS: 31.62V; VOLTAGE_MAX: 75V
R43 = HyTechDevices:RESISTOR_?_*: Resistor PWR163 Series <https://www.mouser.com/datasheet/2/54/pwr163-777985.pdf> AC Series <https://www.mouser.com/datasheet/2/447/Yageo_PYu_AC_51_RoHS_L_7_1714230-1874691.pdf> PU Series <https://www.mouser.com/datasheet/2/447/PYu-PU_51_RoHS_L_6-1504619.pdf> ERA Series <https://www.mouser.com/datasheet/2/315/AOA0000C307-1149632.pdf> PWR263 Series <https://www.mouser.com/datasheet/2/54/pwr263s_35-778069.pdf> KTR Series <https://www.mouser.com/datasheet/2/348/ROHM_S_A0011075115_1-2563276.pdf> RC Series <https://www.mouser.com/datasheet/2/447/Yageo_03_18_2021_PYu_RC_Group_51_RoHS_L_11-2199992.pdf> ERJ PB3, PB6 Series <https://www.mouser.com/datasheet/2/315/AOA0000C328-1530132.pdf> ERJ PA2, P03, PA3, P06, P08, P14 Series <https://www.mouser.com/datasheet/2/315/AOA0000C331-1141874.pdf>; DKPN: RHM365KAHTR-ND; MANUFACTURER: Rohm; MOPN: 755-KTR10EZPF3653; MPN: KTR10EZPF3653; POWER: 0.125W; RESISTANCE: 365k; TOLERANCE: 1%; VOLTAGE_CONTINUOUS: 213V; VOLTAGE_MAX: 350V
R44 = HyTechDevices:RESISTOR_?_*: Resistor PWR163 Series <https://www.mouser.com/datasheet/2/54/pwr163-777985.pdf> AC Series <https://www.mouser.com/datasheet/2/447/Yageo_PYu_AC_51_RoHS_L_7_1714230-1874691.pdf> PU Series <https://www.mouser.com/datasheet/2/447/PYu-PU_51_RoHS_L_6-1504619.pdf> ERA Series <https://www.mouser.com/datasheet/2/315/AOA0000C307-1149632.pdf> PWR263 Series <https://www.mouser.com/datasheet/2/54/pwr263s_35-778069.pdf> KTR Series <https://www.mouser.com/datasheet/2/348/ROHM_S_A0011075115_1-2563276.pdf> RC Series <https://www.mouser.com/datasheet/2/447/Yageo_03_18_2021_PYu_RC_Group_51_RoHS_L_11-2199992.pdf> ERJ PB3, PB6 Series <https://www.mouser.com/datasheet/2/315/AOA0000C328-1530132.pdf> ERJ PA2, P03, PA3, P06, P08, P14 Series <https://www.mouser.com/datasheet/2/315/AOA0000C331-1141874.pdf>; DKPN: P20936TR-ND; MANUFACTURER: Panasonic Electronic Components; MOPN: 667-ERJ-PB6B1004V; MPN: ERJ-PB6B1004V; POWER: 0.25W; RESISTANCE: 1M; TOLERANCE: 0.1%; VOLTAGE_CONTINUOUS: 150V; VOLTAGE_MAX: 150V
R45 = HyTechDevices:RESISTOR_?_*: Resistor PWR163 Series <https://www.mouser.com/datasheet/2/54/pwr163-777985.pdf> AC Series <https://www.mouser.com/datasheet/2/447/Yageo_PYu_AC_51_RoHS_L_7_1714230-1874691.pdf> PU Series <https://www.mouser.com/datasheet/2/447/PYu-PU_51_RoHS_L_6-1504619.pdf> ERA Series <https://www.mouser.com/datasheet/2/315/AOA0000C307-1149632.pdf> PWR263 Series <https://www.mouser.com/datasheet/2/54/pwr263s_35-778069.pdf> KTR Series <https://www.mouser.com/datasheet/2/348/ROHM_S_A0011075115_1-2563276.pdf> RC Series <https://www.mouser.com/datasheet/2/447/Yageo_03_18_2021_PYu_RC_Group_51_RoHS_L_11-2199992.pdf> ERJ PB3, PB6 Series <https://www.mouser.com/datasheet/2/315/AOA0000C328-1530132.pdf> ERJ PA2, P03, PA3, P06, P08, P14 Series <https://www.mouser.com/datasheet/2/315/AOA0000C331-1141874.pdf>; DKPN: YAG1651TR-ND; MANUFACTURER: Yageo; MOPN: 603-RT0603BRD073K32L; MPN: RT0603BRD073K32L; POWER: 0.1W; RESISTANCE: 3.32k; TOLERANCE: 0.1%; VOLTAGE_CONTINUOUS: 18.22V; VOLTAGE_MAX: 75V
R46 = HyTechDevices:RESISTOR_?_*: Resistor PWR163 Series <https://www.mouser.com/datasheet/2/54/pwr163-777985.pdf> AC Series <https://www.mouser.com/datasheet/2/447/Yageo_PYu_AC_51_RoHS_L_7_1714230-1874691.pdf> PU Series <https://www.mouser.com/datasheet/2/447/PYu-PU_51_RoHS_L_6-1504619.pdf> ERA Series <https://www.mouser.com/datasheet/2/315/AOA0000C307-1149632.pdf> PWR263 Series <https://www.mouser.com/datasheet/2/54/pwr263s_35-778069.pdf> KTR Series <https://www.mouser.com/datasheet/2/348/ROHM_S_A0011075115_1-2563276.pdf> RC Series <https://www.mouser.com/datasheet/2/447/Yageo_03_18_2021_PYu_RC_Group_51_RoHS_L_11-2199992.pdf> ERJ PB3, PB6 Series <https://www.mouser.com/datasheet/2/315/AOA0000C328-1530132.pdf> ERJ PA2, P03, PA3, P06, P08, P14 Series <https://www.mouser.com/datasheet/2/315/AOA0000C331-1141874.pdf>; DKPN: P20904TR-ND; MANUFACTURER: Panasonic Electronic Components; MOPN: 667-ERJ-PB6B5233V; MPN: ERJ-PB6B5233V; POWER: 0.25W; RESISTANCE: 523k; TOLERANCE: 0.1%; VOLTAGE_CONTINUOUS: 150V; VOLTAGE_MAX: 150V
R48 = HyTechDevices:RESISTOR_?_*: Resistor PWR163 Series <https://www.mouser.com/datasheet/2/54/pwr163-777985.pdf> AC Series <https://www.mouser.com/datasheet/2/447/Yageo_PYu_AC_51_RoHS_L_7_1714230-1874691.pdf> PU Series <https://www.mouser.com/datasheet/2/447/PYu-PU_51_RoHS_L_6-1504619.pdf> ERA Series <https://www.mouser.com/datasheet/2/315/AOA0000C307-1149632.pdf> PWR263 Series <https://www.mouser.com/datasheet/2/54/pwr263s_35-778069.pdf> KTR Series <https://www.mouser.com/datasheet/2/348/ROHM_S_A0011075115_1-2563276.pdf> RC Series <https://www.mouser.com/datasheet/2/447/Yageo_03_18_2021_PYu_RC_Group_51_RoHS_L_11-2199992.pdf> ERJ PB3, PB6 Series <https://www.mouser.com/datasheet/2/315/AOA0000C328-1530132.pdf> ERJ PA2, P03, PA3, P06, P08, P14 Series <https://www.mouser.com/datasheet/2/315/AOA0000C331-1141874.pdf>; DKPN: RT0603BRE0775KL-ND; MANUFACTURER: Yageo; MOPN: 603-RT0603BRE0775KL; MPN: RT0603BRE0775KL; POWER: 0.1W; RESISTANCE: 75k; TOLERANCE: 0.1%; VOLTAGE_CONTINUOUS: 75V; VOLTAGE_MAX: 75V
R49 R50 = HyTechDevices:RESISTOR_?_*: Resistor PWR163 Series <https://www.mouser.com/datasheet/2/54/pwr163-777985.pdf> AC Series <https://www.mouser.com/datasheet/2/447/Yageo_PYu_AC_51_RoHS_L_7_1714230-1874691.pdf> PU Series <https://www.mouser.com/datasheet/2/447/PYu-PU_51_RoHS_L_6-1504619.pdf> ERA Series <https://www.mouser.com/datasheet/2/315/AOA0000C307-1149632.pdf> PWR263 Series <https://www.mouser.com/datasheet/2/54/pwr263s_35-778069.pdf> KTR Series <https://www.mouser.com/datasheet/2/348/ROHM_S_A0011075115_1-2563276.pdf> RC Series <https://www.mouser.com/datasheet/2/447/Yageo_03_18_2021_PYu_RC_Group_51_RoHS_L_11-2199992.pdf> ERJ PB3, PB6 Series <https://www.mouser.com/datasheet/2/315/AOA0000C328-1530132.pdf> ERJ PA2, P03, PA3, P06, P08, P14 Series <https://www.mouser.com/datasheet/2/315/AOA0000C331-1141874.pdf>; DKPN: P20144TR-ND; MANUFACTURER: Panasonic Electronic Components; MOPN: 667-ERJ-PB3B3322V; MPN: ERJ-PB3B3322V; POWER: 0.1W; RESISTANCE: 33.2k; TOLERANCE: 0.1%; VOLTAGE_CONTINUOUS: 57.6V; VOLTAGE_MAX: 75V
R51 = HyTechDevices:RESISTOR_?_*: Resistor PWR163 Series <https://www.mouser.com/datasheet/2/54/pwr163-777985.pdf> AC Series <https://www.mouser.com/datasheet/2/447/Yageo_PYu_AC_51_RoHS_L_7_1714230-1874691.pdf> PU Series <https://www.mouser.com/datasheet/2/447/PYu-PU_51_RoHS_L_6-1504619.pdf> ERA Series <https://www.mouser.com/datasheet/2/315/AOA0000C307-1149632.pdf> PWR263 Series <https://www.mouser.com/datasheet/2/54/pwr263s_35-778069.pdf> KTR Series <https://www.mouser.com/datasheet/2/348/ROHM_S_A0011075115_1-2563276.pdf> RC Series <https://www.mouser.com/datasheet/2/447/Yageo_03_18_2021_PYu_RC_Group_51_RoHS_L_11-2199992.pdf> ERJ PB3, PB6 Series <https://www.mouser.com/datasheet/2/315/AOA0000C328-1530132.pdf> ERJ PA2, P03, PA3, P06, P08, P14 Series <https://www.mouser.com/datasheet/2/315/AOA0000C331-1141874.pdf>; DKPN: P154KDBCT-ND; MANUFACTURER: Panasonic Electronic Components; MOPN: 667-ERA-3AEB1543V; MPN: ERA-3AEB1543V; POWER: 0.1W; RESISTANCE: 154k; TOLERANCE: 0.1%; VOLTAGE_CONTINUOUS: 75V; VOLTAGE_MAX: 75V
TP1-TP16 TP18-TP20 = HyTechDevices:TEST_POINT: Test Point; DKPN: 36-5015CT-ND; MANUFACTURER: Keystone Electronics; MOPN: 534-5015; MPN: 5015
U1 = HyTechDevices:LTC6994_*: Analog Electronics Delay IC Datasheet <https://www.mouser.com/datasheet/2/609/LTC6994_1_6994_2-1270043.pdf>; DKPN: 505-LTC6994CS6-1#TRMPBFTR-ND; MANUFACTURER: Analog Electronics; MOPN: 584-C6994CS6-1TRMPBF; MPN: LTC6994CS6-1#TRMPBF
U2 = HyTechDevices:VOLTAGE_REGULATOR_?_*: Voltage Regulators LDL1117S50R Datasheet <https://www.mouser.com/datasheet/2/389/dm00366442-1799212.pdf> NCP785AH120T1G <https://www.mouser.com/datasheet/2/308/NCP785A_D-1812704.pdf>; DKPN: 497-17240-1-ND; MANUFACTURER: STMicroelectronics; MOPN: 511-LDL1117S50R; MPN: LDL1117S50R
U10 = HyTechDevicesTempTSB:DCM4623TD2J13D0T70: 400W 300V to 12V step-down DC-DC converter Datasheet <https://www.mouser.com/datasheet/2/685/DCM4623xD2J13D0y7z_ds-1144763.pdf>; DKPN: 1102-DCM4623TD2J13D0T70-ND; MANUFACTURER: Vicor; MOPN: 492-DCM4623D2J13D0T7; MPN: DCM4623TD2J13D0T70
U11 = HyTechDevicesTempTSB:RELAY_SOLIDSTATE_NC_?: Normally Closed Solid-State Relay Datasheet <file:///C:/Users/kamin/Downloads/semi_eng_ge1b_aqy41_e%20(1).pdf>; DKPN: 255-2897-ND; MANUFACTURER: Panasonic Industrial Devices; MOPN: 769-AQY414EHA; MPN: AQY414EHA
U15 = HyTechDevices:LOGICGATE_INVERTER_: Inverter SN74LVC Datasheet <https://www.ti.com/lit/ds/symlink/sn74lvc1g04.pdf>; DKPN: 2156-SN74LVC1G04DCKR-ND; MANUFACTURER: Texas Instruments; MOPN: 595-SN74LVC1G04DCKR; MPN: SN74LVC1G04DCKR
U16 = HyTechDevices:LTC3639: LTC3639 Datasheet <https://www.mouser.com/datasheet/2/609/3639fd-1271210.pdf>; DKPN: LTC3639EMSE#TRPBFTR-ND; MANUFACTURER: Analog Devices Inc.; MOPN: 584-LTC3639EMSETRPBF; MPN: LTC3639EMSE#TRPBF
U17 = HyTechDevices:VOLTAGE_REGULATOR_ADJ_*_?: Adjustable voltage regulators. LR8 Datasheet <https://ww1.microchip.com/downloads/en/DeviceDoc/20005399B.pdf>; DKPN: LR8K4-GTR-ND; MANUFACTURER: Microchip Technology; MOPN: 689-LR8K4-G; MPN: LR8K4-G
U18 U19 = HyTechDevices:ISO224*: ISO224*: Isolated precision amplifier ISO224A: Low-Grade ISO224B: High-Grade ISO224* Datasheet <https://www.ti.com/lit/ds/symlink/iso224.pdf?HQS=dis-dk-null-digikeymode-dsf-pf-null-wwe&ts=1625423566252&ref_url=https%253A%252F%252Fwww.ti.com%252Fgeneral%252Fdocs%252Fsuppproductinfo.tsp%253FdistId%253D10%2526gotoUrl%253Dhttps%253A%252F%252Fwww.ti.com%252Flit%252Fgpn%252Fiso224>; DKPN: 296-52316-1-ND; MANUFACTURER: Texas Instruments; MOPN: 595-ISO224BDWVR; MPN: ISO224BDWVR
U$1 = HyTechDevices:RELAY_SOLIDSTATE_NO: AQY214EH Normally Open Solid State Relay Datasheet <https://www.datasheetq.com/datasheet-download/287654/1/Panasonic/AQY214EH>; DKPN: 255-1436-5-ND; MANUFACTURER: AQY214EHA; MOPN: 769-AQY214EHA; MPN: AQY214EHA
XF1 = HyTechDevices:FUSE_HOLDER_*: Fuse Holder All PNs for the holder; if Miniblade Fuses <https://www.littelfuse.com/media?resourcetype=datasheets&itemid=0f5f58cb-559e-494b-8d53-723f30445ae5&filename=littelfuse-mini-datasheet> needed, order separately. Mini-Blade PTH <https://www.mouser.com/datasheet/2/215/3568-742601.pdf> Mini-Blade SMD <https://www.mouser.com/datasheet/2/215/588-744913.pdf>; DKPN: 36-3568-ND; MANUFACTURER: Keystone; MOPN: 534-3568; MPN: 3568